# EAGLE design tarjeta-v8 (EAGLE 6.4)
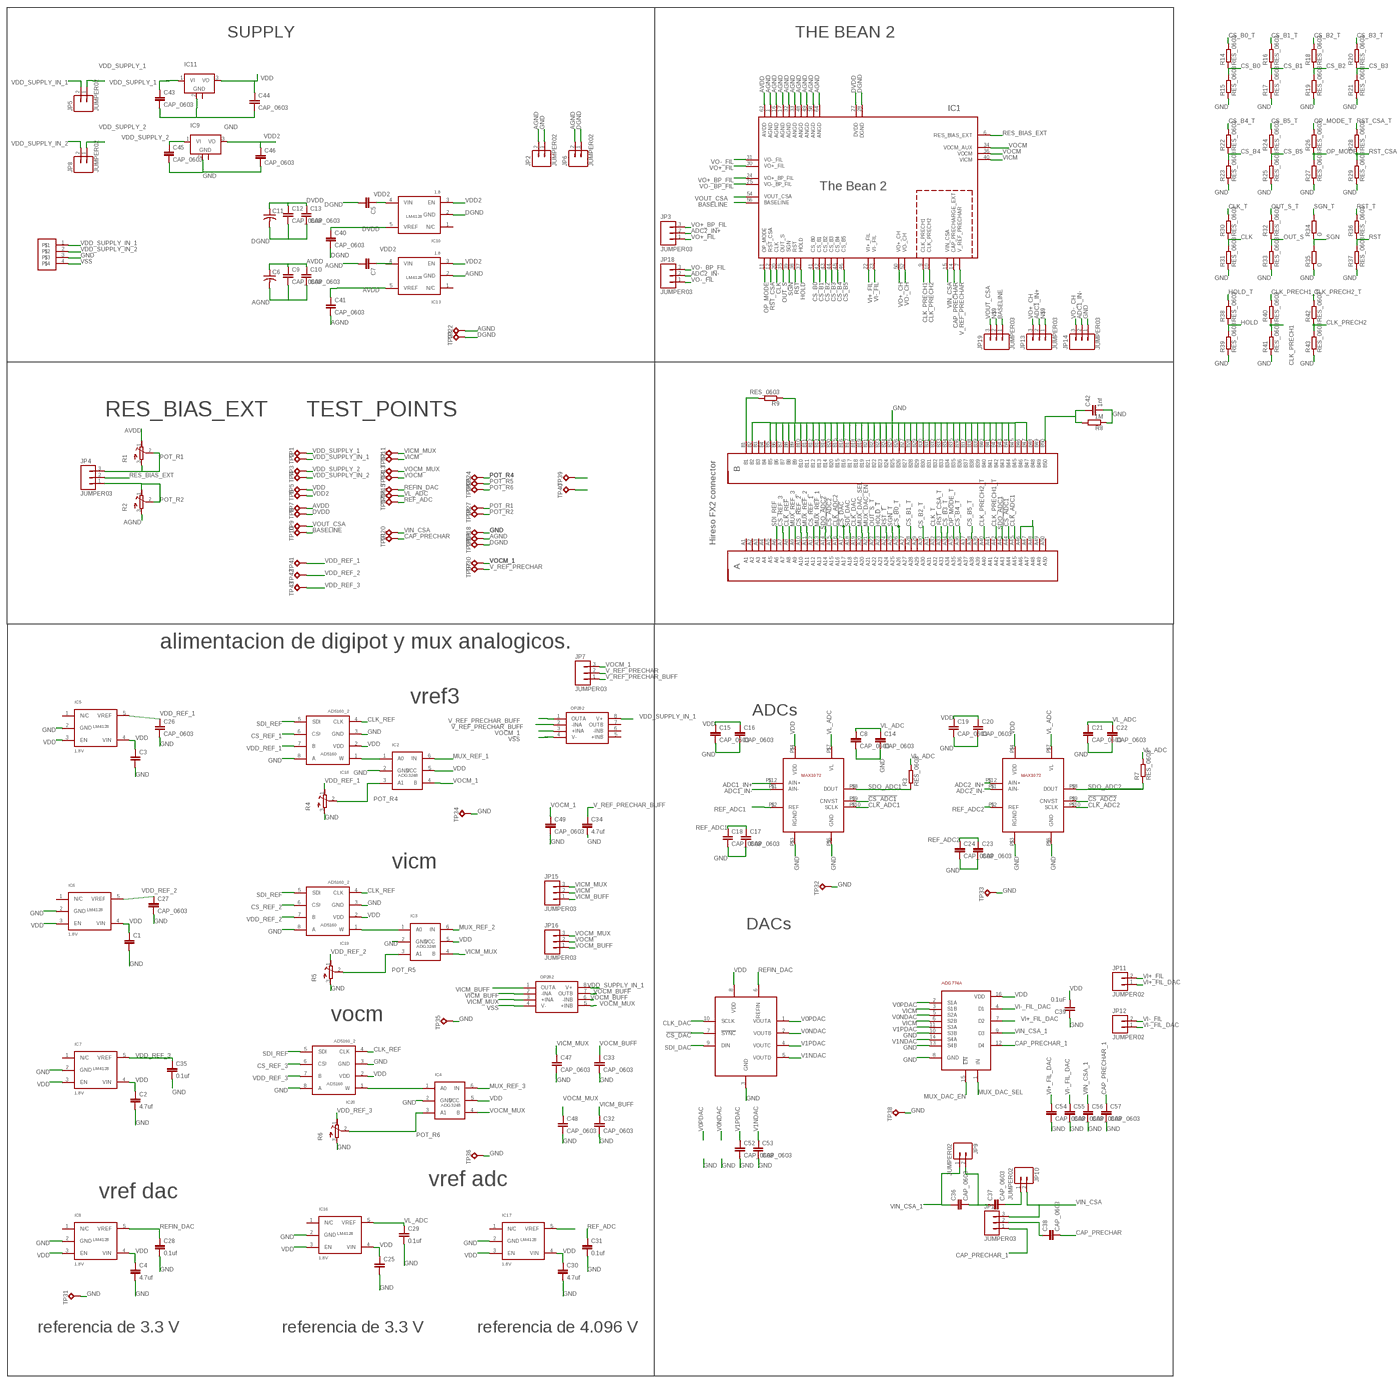
[diagram p0: schematic, sheet 1, overview]
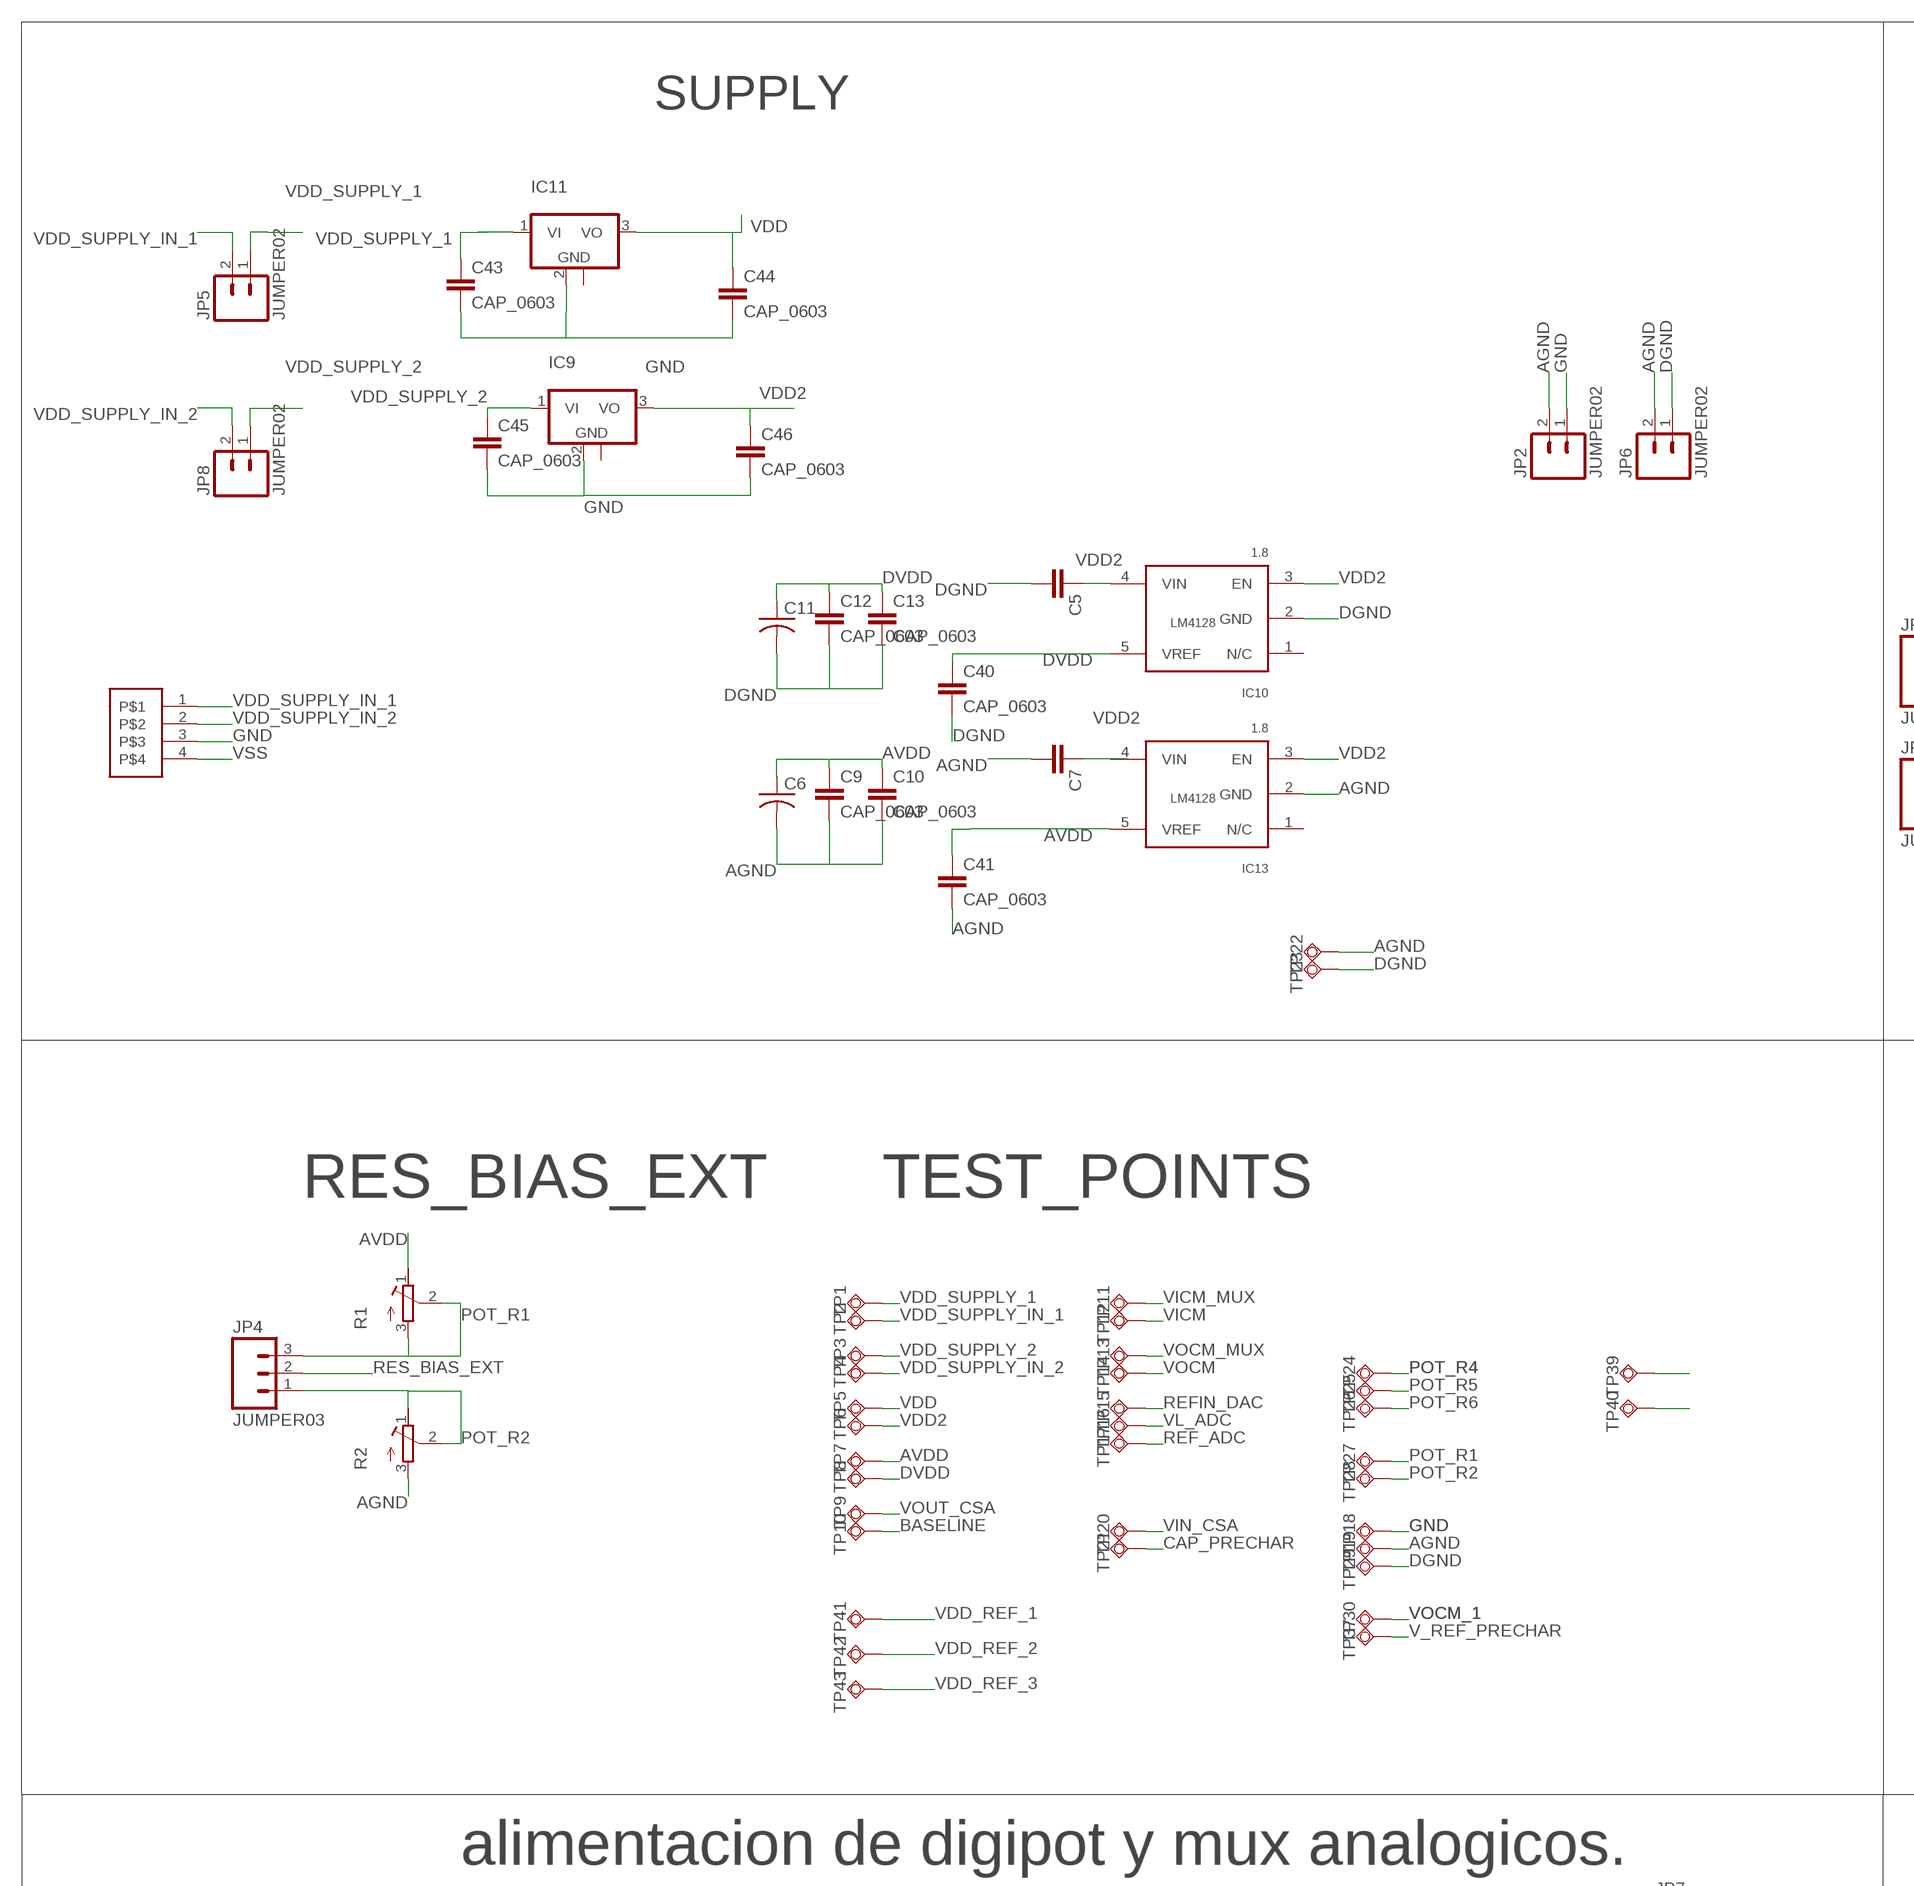
[diagram p1: schematic, sheet 1, part 1 of 4]
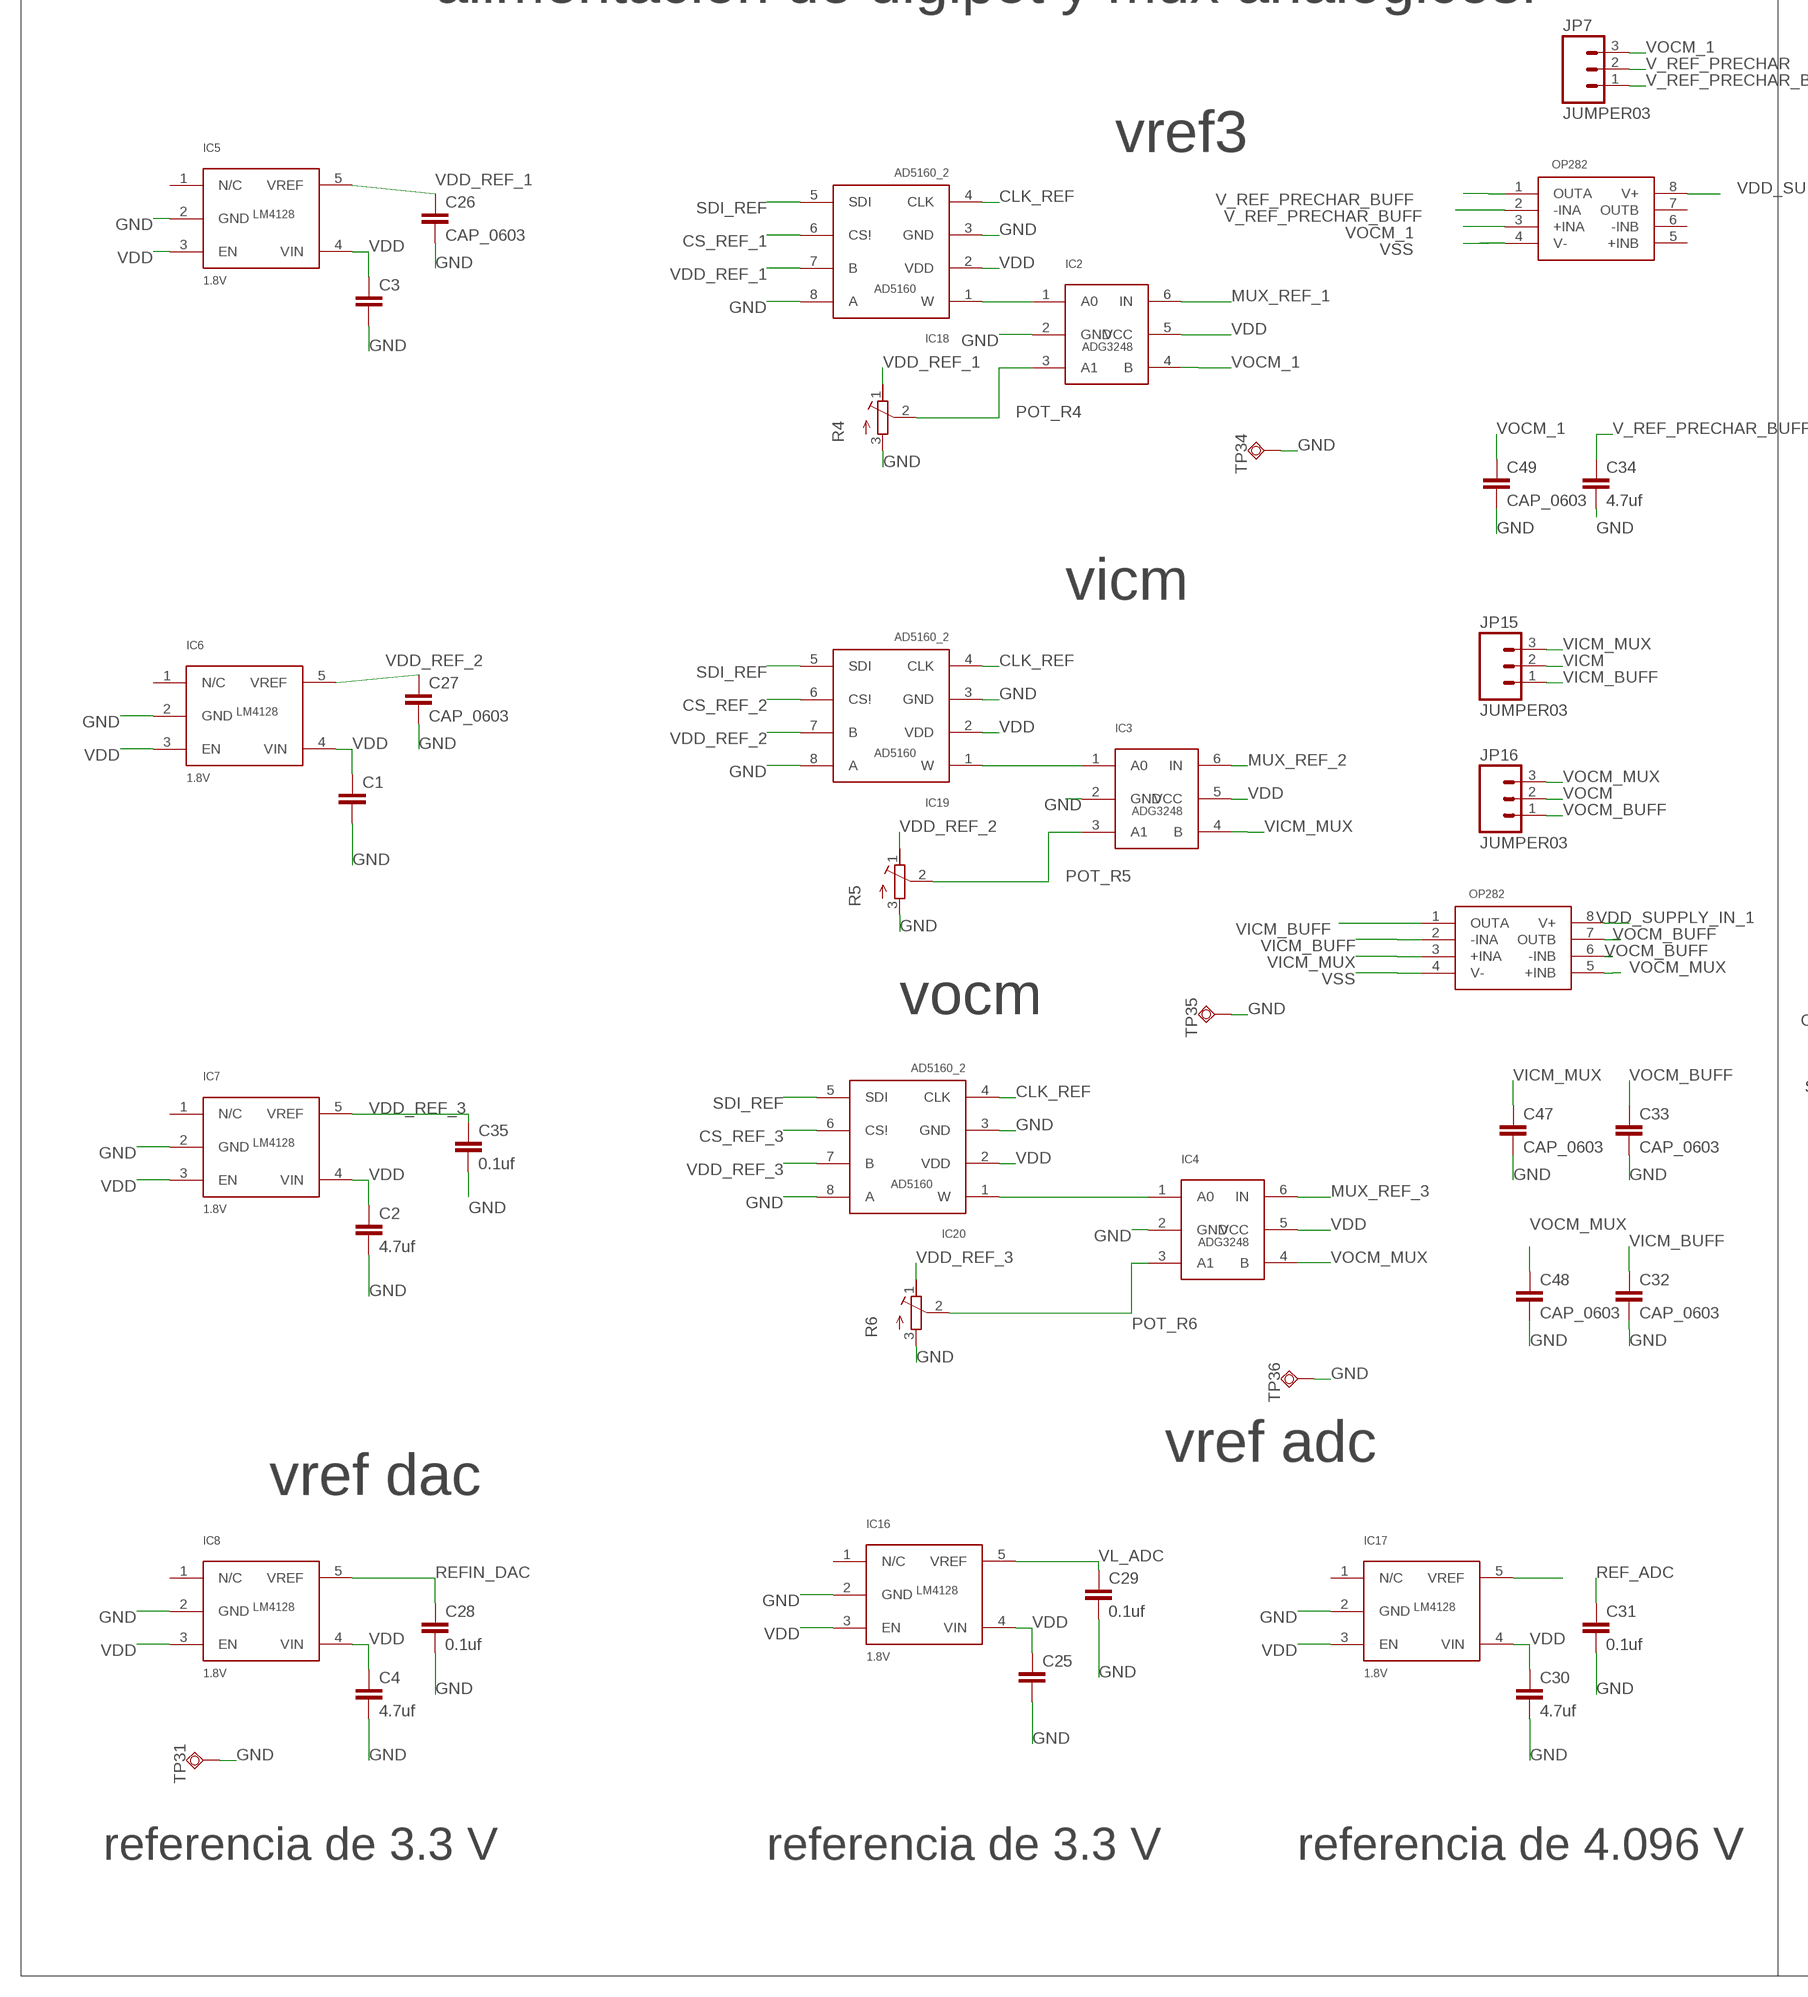
[diagram p2: schematic, sheet 1, part 2 of 4]
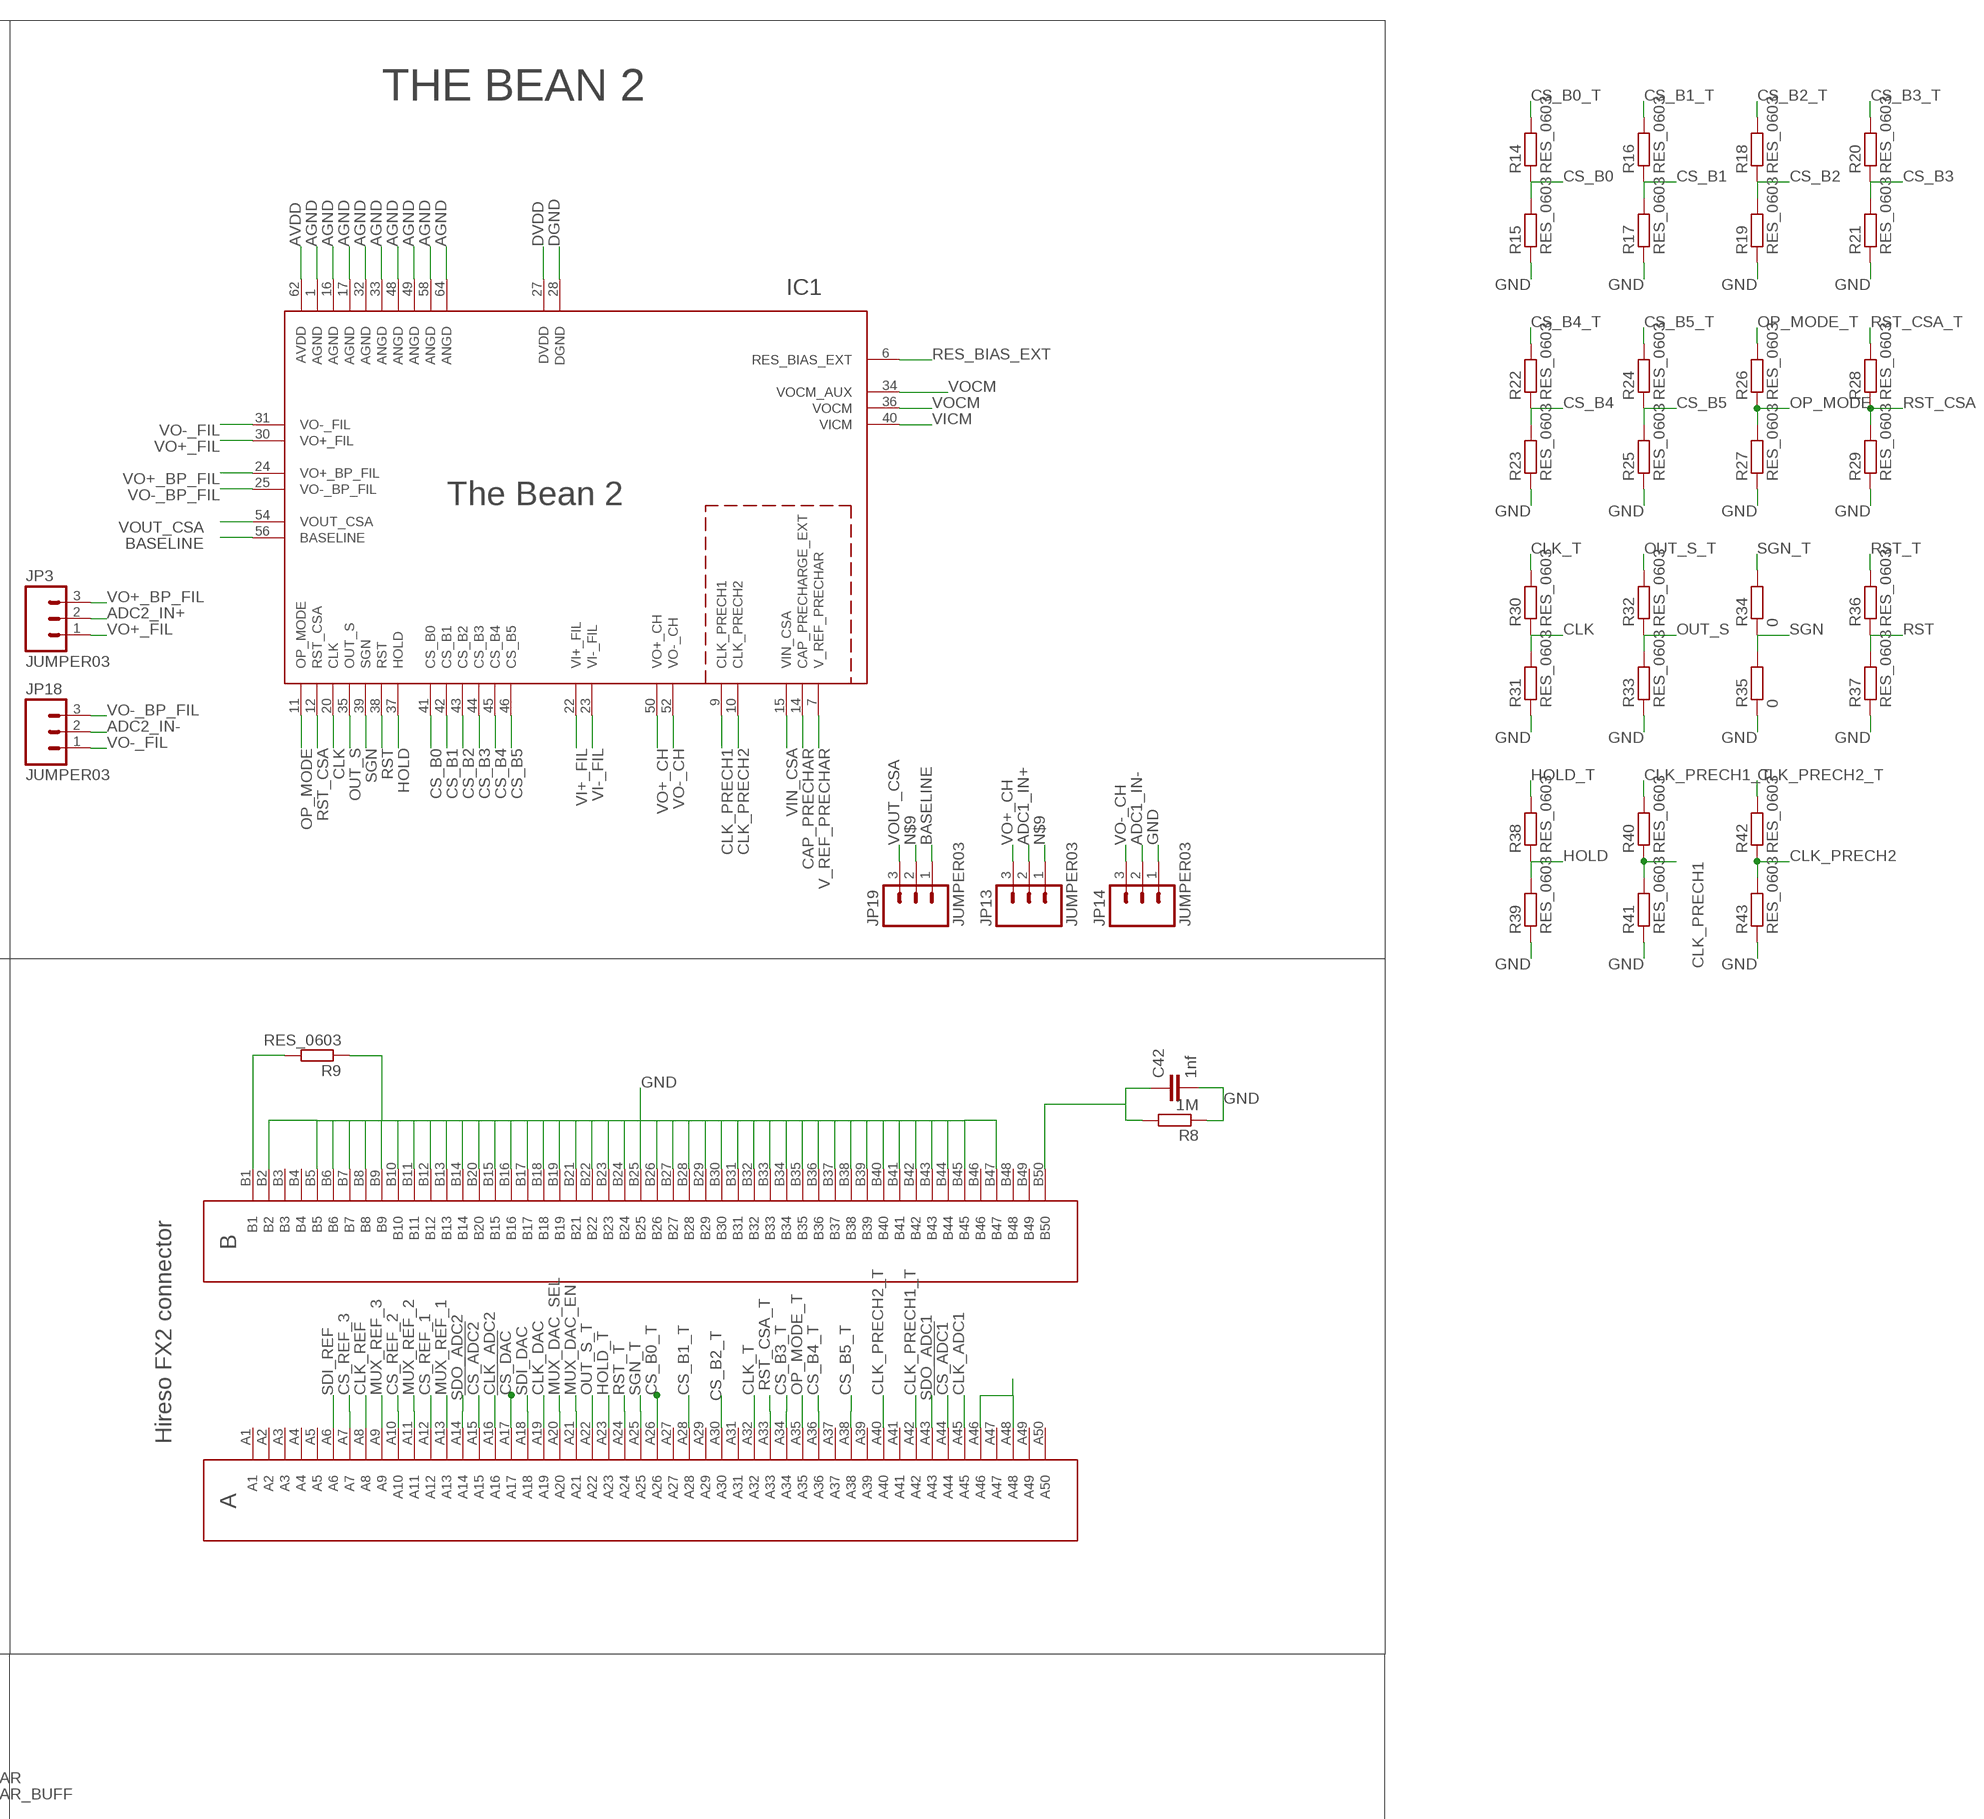
[diagram p3: schematic, sheet 1, part 3 of 4]
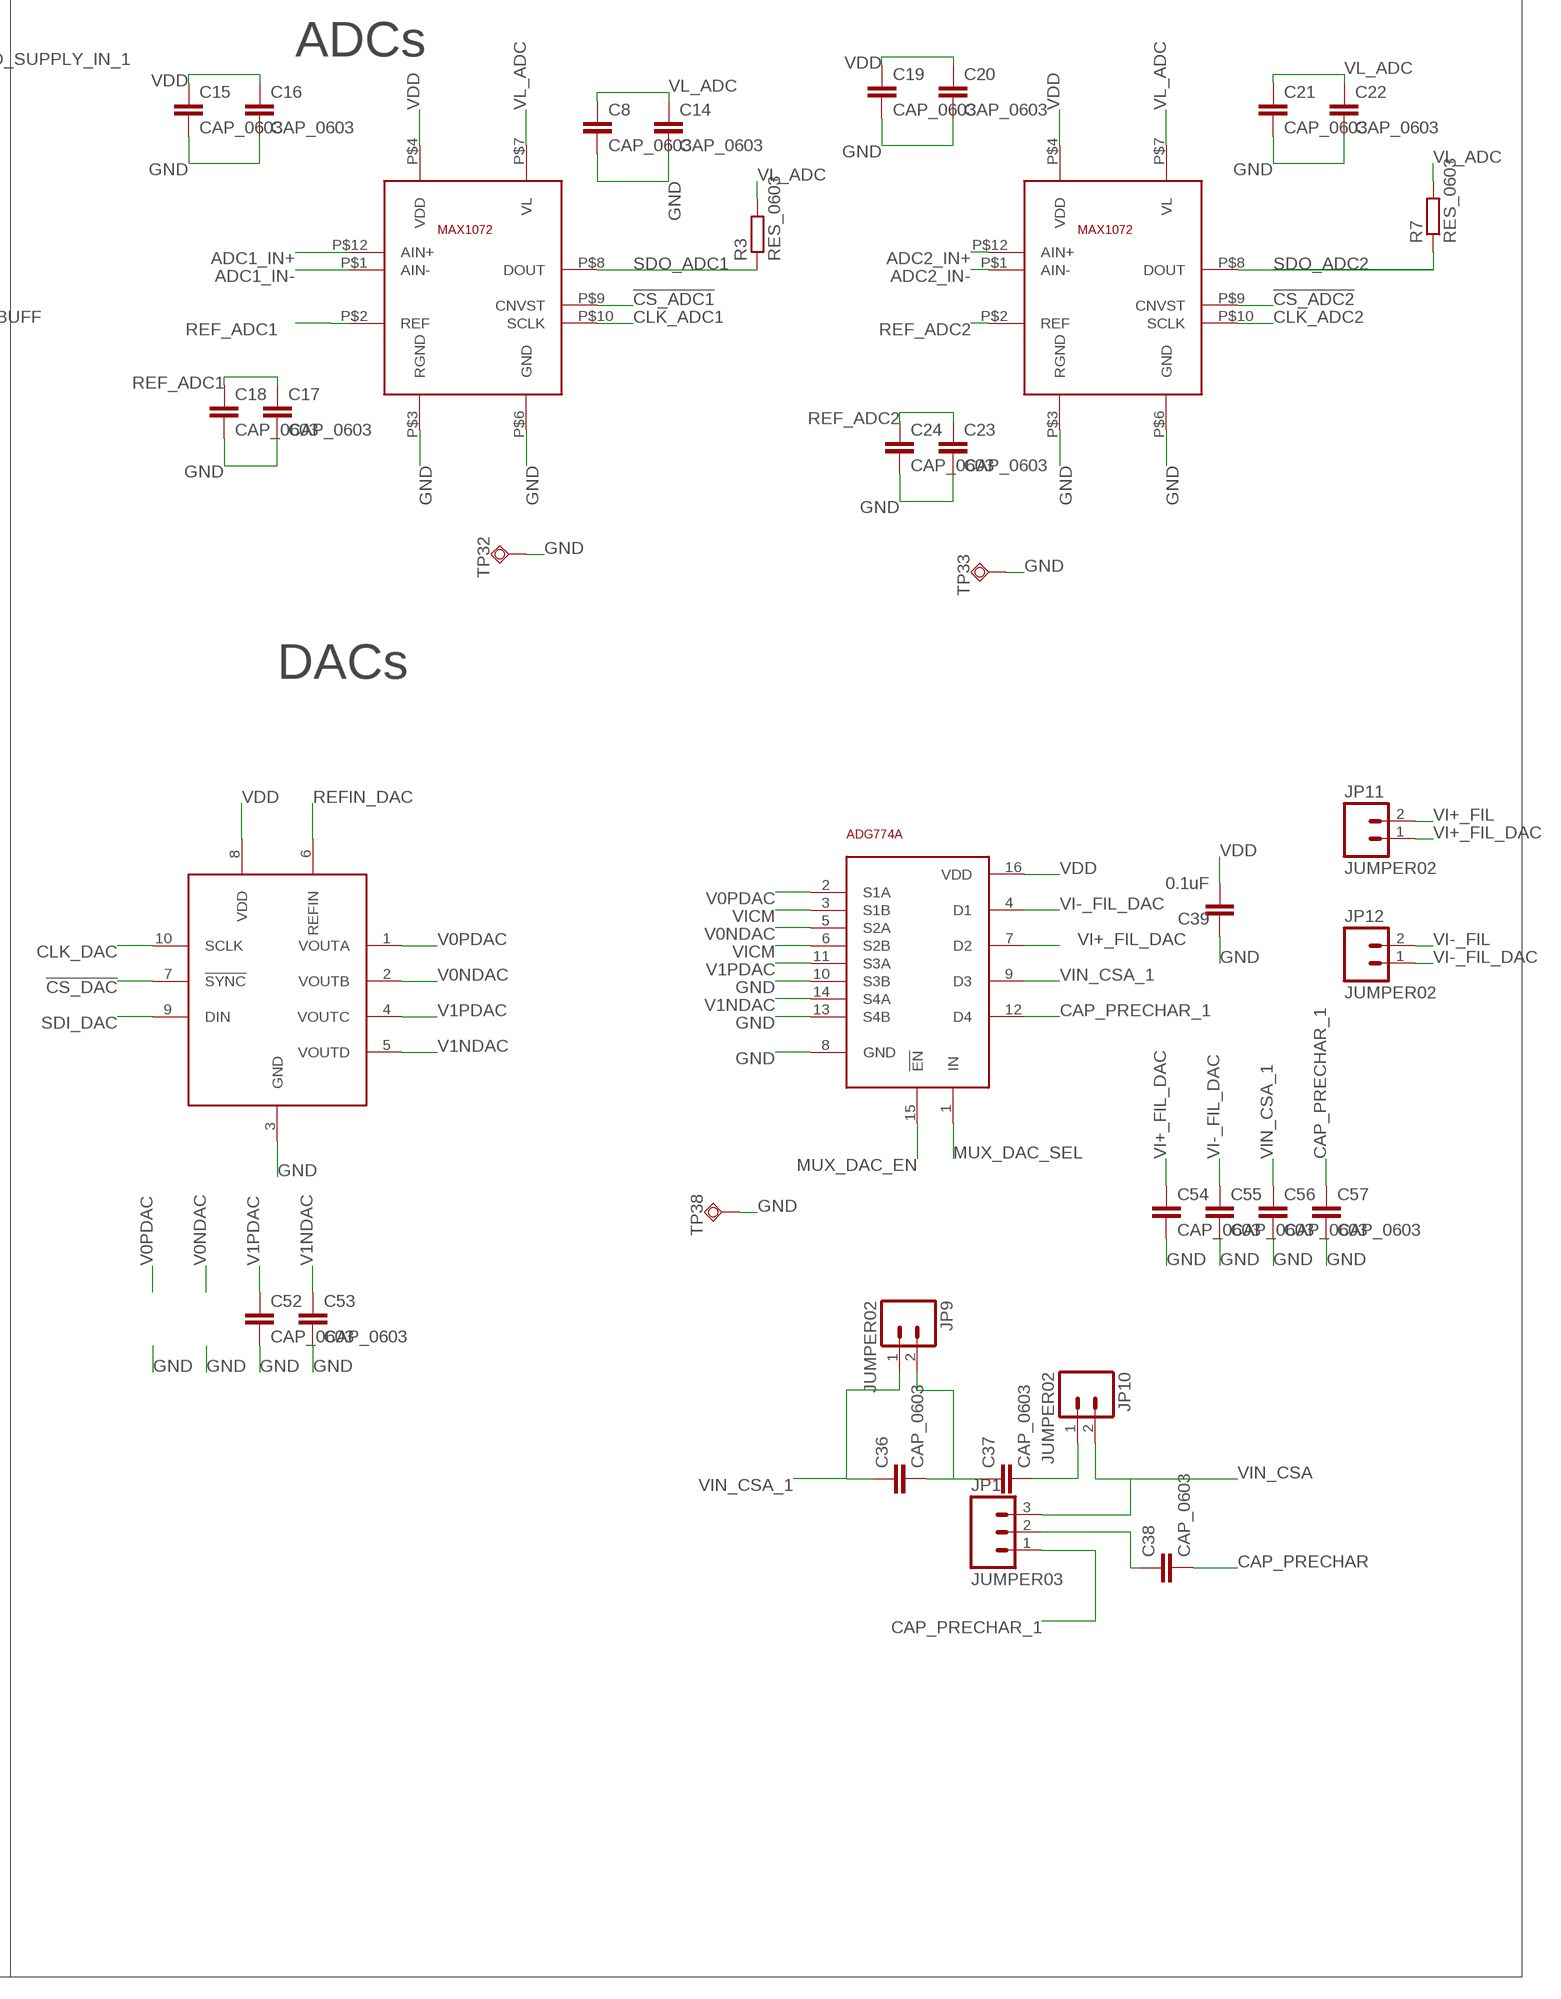
[diagram p4: schematic, sheet 1, part 4 of 4]

## Parts
C1  CAP_0402  [C0402]
C2  4.7uf  CAP_0402  [C0402]
C3  CAP_0402  [C0402]
C4  4.7uf  CAP_0402  [C0402]
C5  CAP_0402  [C0402]
C6  CAP_0805  [C0805]
C7  CAP_0402  [C0402]
C8  CAP_0603  [C0603]
C9  CAP_0603  [C0603]
C10  CAP_0603  [C0603]
C11  CAP_0805  [C0805]
C12  CAP_0603  [C0603]
C13  CAP_0603  [C0603]
C14  CAP_0603  [C0603]
C15  CAP_0603  [C0603]
C16  CAP_0603  [C0603]
C17  CAP_0603  [C0603]
C18  CAP_0603  [C0603]
C19  CAP_0603  [C0603]
C20  CAP_0603  [C0603]
C21  CAP_0603  [C0603]
C22  CAP_0603  [C0603]
C23  CAP_0603  [C0603]
C24  CAP_0603  [C0603]
C25  CAP_0402  [C0402]
C26  CAP_0603  [C0603]
C27  CAP_0603  [C0603]
C28  0.1uf  CAP_0603  [C0603]
C29  0.1uf  CAP_0603  [C0603]
C30  4.7uf  CAP_0402  [C0402]
C31  0.1uf  CAP_0603  [C0603]
C32  CAP_0603  [C0603]
C33  CAP_0603  [C0603]
C34  4.7uf  CAP_0603  [C0603]
C35  0.1uf  CAP_0603  [C0603]
C36  CAP_0603  [C0603]
C37  CAP_0603  [C0603]
C38  CAP_0603  [C0603]
C39  0.1uF  CAP_0603  [C0603]
C40  CAP_0603  [C0603]
C41  CAP_0603  [C0603]
C42  1nf  CAP_0603  [C0603]
C43  CAP_0603  [C0603]
C44  CAP_0603  [C0603]
C45  CAP_0603  [C0603]
C46  CAP_0603  [C0603]
C47  CAP_0603  [C0603]
C48  CAP_0603  [C0603]
C49  CAP_0603  [C0603]
C52  CAP_0603  [C0603]
C53  CAP_0603  [C0603]
C54  CAP_0603  [C0603]
C55  CAP_0603  [C0603]
C56  CAP_0603  [C0603]
C57  CAP_0603  [C0603]
IC1  THE_BEAN_2  [QFN64]
IC2  ADG3248  [SC70]
IC3  ADG3248  [SC70]
IC4  ADG3248  [SC70]
IC5  1.8V  LM4128_2  [SOT23-5L_2]
IC6  1.8V  LM4128_2  [SOT23-5L_2]
IC7  1.8V  LM4128_2  [SOT23-5L_2]
IC8  1.8V  LM4128_2  [SOT23-5L_2]
IC9  UA78M33DCY  [SOT223]
IC10  1.8  LM4128_2  [SOT23-5L_2]
IC11  UA78M33DCY  [SOT223]
IC12  OP282  [MSOP8]
IC13  1.8  LM4128_2  [SOT23-5L_2]
IC14  OP282  [MSOP8]
IC16  1.8V  LM4128_2  [SOT23-5L_2]
IC17  1.8V  LM4128_2  [SOT23-5L_2]
IC18  AD5160_2  [SOT23-8_2]
IC19  AD5160_2  [SOT23-8_2]
IC20  AD5160_2  [SOT23-8_2]
IC21  ADG774A  [QSOP16]
IC22  MAX1072  [TQFN12]
IC23  DAC7554  [MSOP10]
J1  HIRESO_FX_CONNECTOR  [FX2-100S-1.27]
JP1  JUMPER03  [1X03]
JP2  JUMPER02  [1X02]
JP3  JUMPER03  [1X03]
JP4  JUMPER03  [1X03]
JP5  JUMPER02  [1X02]
JP6  JUMPER02  [1X02]
JP7  JUMPER03  [1X03]
JP8  JUMPER02  [1X02]
JP9  JUMPER02  [1X02]
JP10  JUMPER02  [1X02]
JP11  JUMPER02  [1X02]
JP12  JUMPER02  [1X02]
JP13  JUMPER03  [1X03]
JP14  JUMPER03  [1X03]
JP15  JUMPER03  [1X03]
JP16  JUMPER03  [1X03]
JP17  JUMPER04  [1X04]
JP18  JUMPER03  [1X03]
JP19  JUMPER03  [1X03]
R1  TRIMMER_ST5  [ST-5EW]
R2  TRIMMER_ST5  [ST-5EW]
R3  RES_0603  [R0603]
R4  TRIMMER_ST5  [ST-5EW]
R5  TRIMMER_ST5  [ST-5EW]
R6  TRIMMER_ST5  [ST-5EW]
R7  RES_0603  [R0603]
R8  1M  RES_0603  [R0603]
R9  RES_0603  [R0603]
R14  RES_0603  [R0603]
R15  RES_0603  [R0603]
R16  RES_0603  [R0603]
R17  RES_0603  [R0603]
R18  RES_0603  [R0603]
R19  RES_0603  [R0603]
R20  RES_0603  [R0603]
R21  RES_0603  [R0603]
R22  RES_0603  [R0603]
R23  RES_0603  [R0603]
R24  RES_0603  [R0603]
R25  RES_0603  [R0603]
R26  RES_0603  [R0603]
R27  RES_0603  [R0603]
R28  RES_0603  [R0603]
R29  RES_0603  [R0603]
R30  RES_0603  [R0603]
R31  RES_0603  [R0603]
R32  RES_0603  [R0603]
R33  RES_0603  [R0603]
R34  0  RES_0603  [R0603]
R35  0  RES_0603  [R0603]
R36  RES_0603  [R0603]
R37  RES_0603  [R0603]
R38  RES_0603  [R0603]
R39  RES_0603  [R0603]
R40  RES_0603  [R0603]
R41  RES_0603  [R0603]
R42  RES_0603  [R0603]
R43  RES_0603  [R0603]
TP1  TEST_POINT  [TP]
TP2  TEST_POINT  [TP]
TP3  TEST_POINT  [TP]
TP4  TEST_POINT  [TP]
TP5  TEST_POINT  [TP]
TP6  TEST_POINT  [TP]
TP7  TEST_POINT  [TP]
TP8  TEST_POINT  [TP]
TP9  TEST_POINT  [TP]
TP10  TEST_POINT  [TP]
TP11  TEST_POINT  [TP]
TP12  TEST_POINT  [TP]
TP13  TEST_POINT  [TP]
TP14  TEST_POINT  [TP]
TP15  TEST_POINT  [TP]
TP16  TEST_POINT  [TP]
TP17  TEST_POINT  [TP]
TP18  TEST_POINT  [TP]
TP19  TEST_POINT  [TP]
TP20  TEST_POINT  [TP]
TP21  TEST_POINT  [TP]
TP22  TEST_POINT  [TP]
TP23  TEST_POINT  [TP]
TP24  TEST_POINT  [TP]
TP25  TEST_POINT  [TP]
TP26  TEST_POINT  [TP]
TP27  TEST_POINT  [TP]
TP28  TEST_POINT  [TP]
TP29  TEST_POINT  [TP]
TP30  TEST_POINT  [TP]
TP31  TEST_POINT  [TP]
TP32  TEST_POINT  [TP]
TP33  TEST_POINT  [TP]
TP34  TEST_POINT  [TP]
TP35  TEST_POINT  [TP]
TP36  TEST_POINT  [TP]
TP37  TEST_POINT  [TP]
TP38  TEST_POINT  [TP]
TP39  TEST_POINT  [TP]
TP40  TEST_POINT  [TP]
TP41  TEST_POINT  [TP]
TP42  TEST_POINT  [TP]
TP43  TEST_POINT  [TP]
U$5  MAX1072  [TQFN12]

## Nets
!CS_ADC1: IC22.P$9(CNVST) J1.A44
!CS_ADC2: J1.A15 U$5.P$9(CNVST)
!CS_DAC: IC23.7(!SYNC) J1.A17
ADC1_IN+: IC22.P$12(AIN+) JP13.2
ADC1_IN-: IC22.P$1(AIN-) JP14.2
ADC2_IN+: JP3.2 U$5.P$12(AIN+)
ADC2_IN-: JP18.2 U$5.P$1(AIN-)
AGND: C6.2 C7.2 C9.2 C10.2 C41.2 IC1.1(AGND) IC1.16(AGND) IC1.17(AGND) IC1.32(AGND) IC1.33(ANGD) IC1.48(ANGD) IC1.49(ANGD) IC1.58(ANGD) IC1.64(ANGD) IC13.2(GND) JP2.2 JP6.2 R2.3 TP19.TP TP22.TP
AVDD: C6.1 C9.1 C10.1 C41.1 IC1.62(AVDD) IC13.5(VREF) R1.1 TP7.TP
BASELINE: IC1.56(BASELINE) JP19.1 TP10.TP
CAP_PRECHAR: C38.2 IC1.14(CAP_PRECHARGE_EXT) TP21.TP
CAP_PRECHAR_1: C57.1 IC21.12(D4) JP1.1
CLK: IC1.20(CLK) R30.1 R31.2
CLK_ADC1: IC22.P$10(SCLK) J1.A45
CLK_ADC2: J1.A16 U$5.P$10(SCLK)
CLK_DAC: IC23.10(SCLK) J1.A19
CLK_PRECH1: IC1.9(CLK_PRECH1) R40.1 R41.2
CLK_PRECH1_T: J1.A42 R40.2
CLK_PRECH2: IC1.10(CLK_PRECH2) R42.1 R43.2
CLK_PRECH2_T: J1.A40 R42.2
CLK_REF: IC18.4(CLK) IC19.4(CLK) IC20.4(CLK) J1.A8
CLK_T: J1.A32 R30.2
CS_B0: IC1.41(CS_B0) R14.1 R15.2
CS_B0_T: J1.A26 R14.2
CS_B1: IC1.42(CS_B1) R16.1 R17.2
CS_B1_T: J1.A28 R16.2
CS_B2: IC1.43(CS_B2) R18.1 R19.2
CS_B2_T: J1.A30 R18.2
CS_B3: IC1.44(CS_B3) R20.1 R21.2
CS_B3_T: J1.A34 R20.2
CS_B4: IC1.45(CS_B4) R22.1 R23.2
CS_B4_T: J1.A36 R22.2
CS_B5: IC1.46(CS_B5) R24.1 R25.2
CS_B5_T: J1.A38 R24.2
CS_REF_1: IC18.6(CS!) J1.A12
CS_REF_2: IC19.6(CS!) J1.A10
CS_REF_3: IC20.6(CS!) J1.A7
DGND: C5.2 C11.2 C12.2 C13.2 C40.2 IC1.28(DGND) IC10.2(GND) JP6.1 TP23.TP TP29.TP
DVDD: C11.1 C12.1 C13.1 C40.1 IC1.27(DVDD) IC10.5(VREF) TP8.TP
GND: C1.2 C2.2 C3.2 C4.2 C8.2 C14.2 C15.2 C16.2 C17.2 C18.2 C19.2 C20.2 C21.2 C22.2 C23.2 C24.2 C25.2 C26.2 C27.2 C28.2 C29.2 C30.2 C31.2 C32.2 C33.2 C34.2 C35.2 C39.1 C42.2 C43.2 C44.2 C45.2 C46.2 C47.2 C48.2 C49.2 C52.2 C53.2 C54.2 C55.2 C56.2 C57.2 IC2.2(GND) IC3.2(GND) IC4.2(GND) IC5.2(GND) IC6.2(GND) IC7.2(GND) IC8.2(GND) IC9.2(GND) IC11.2(GND) IC16.2(GND) IC17.2(GND) IC18.3(GND) IC18.8(A) IC19.3(GND) IC19.8(A) IC20.3(GND) IC20.8(A) IC21.8(GND) IC21.10(S3B) IC21.13(S4B) IC22.P$3(RGND) IC22.P$6(GND) IC23.3(GND) J1.B2 J1.B5 J1.B6 J1.B7 J1.B8 J1.B9 J1.B10 J1.B11 J1.B12 J1.B13 J1.B14 J1.B15 J1.B16 J1.B17 J1.B18 J1.B19 J1.B20 J1.B21 J1.B22 J1.B23 J1.B24 J1.B25 J1.B26 J1.B27 J1.B28 J1.B29 J1.B30 J1.B31 J1.B32 J1.B33 J1.B34 J1.B35 J1.B36 J1.B37 J1.B38 J1.B39 J1.B40 J1.B41 J1.B42 J1.B43 J1.B44 J1.B45 J1.B47 JP2.1 JP14.1 JP17.3 R4.3 R5.3 R6.3 R8.1 R9.1 R15.1 R17.1 R19.1 R21.1 R23.1 R25.1 R27.1 R29.1 R31.1 R33.1 R35.1 R37.1 R39.1 R41.1 R43.1 TP18.TP TP31.TP TP32.TP TP33.TP TP34.TP TP35.TP TP36.TP TP38.TP U$5.P$3(RGND) U$5.P$6(GND)
HOLD: IC1.37(HOLD) R38.1 R39.2
HOLD_T: J1.A23 R38.2
MUX_DAC_EN: IC21.15(!EN) J1.A21
MUX_DAC_SEL: IC21.1(IN) J1.A20
MUX_REF_1: IC2.6(IN) J1.A13
MUX_REF_2: IC3.6(IN) J1.A11
MUX_REF_3: IC4.6(IN) J1.A9
N$1: C36.2 C37.1 JP9.2
N$2: J1.B1 R9.2
N$3: C37.2 JP10.1
N$4: J1.A46 J1.A48
N$5: IC4.1(A0) IC20.1(W)
N$6: C38.1 JP1.2
N$7: IC17.5(VREF)
N$9: JP13.1 JP19.2
N$10: C42.1 J1.B50 R8.2
N$17: IC2.1(A0) IC18.1(W)
N$19: IC3.1(A0) IC19.1(W)
OP_MODE: IC1.11(OP_MODE) R26.1 R27.2
OP_MODE_T: J1.A35 R26.2
OUT_S: IC1.35(OUT_S) R32.1 R33.2
OUT_S_T: J1.A22 R32.2
POT_R1: JP4.3 R1.2 R1.3 TP27.TP
POT_R2: JP4.1 R2.1 R2.2 TP28.TP
POT_R4: IC2.3(A1) R4.2 TP24.TP
POT_R5: IC3.3(A1) R5.2 TP25.TP
POT_R6: IC4.3(A1) R6.2 TP26.TP
REF_ADC: C31.1 TP17.TP
REF_ADC1: C17.1 C18.1 IC22.P$2(REF) TP39.TP
REF_ADC2: C23.1 C24.1 TP40.TP U$5.P$2(REF)
REFIN_DAC: C28.1 IC8.5(VREF) IC23.6(REFIN) TP15.TP
RES_BIAS_EXT: IC1.6(RES_BIAS_EXT) JP4.2
RST: IC1.38(RST) R36.1 R37.2
RST_CSA: IC1.12(RST_CSA) R28.1 R29.2
RST_CSA_T: J1.A33 R28.2
RST_T: J1.A24 R36.2
SDI_DAC: IC23.9(DIN) J1.A18
SDI_REF: IC18.5(SDI) IC19.5(SDI) IC20.5(SDI) J1.A6
SDO_ADC1: IC22.P$8(DOUT) J1.A43 R3.1
SDO_ADC2: J1.A14 R7.1 U$5.P$8(DOUT)
SGN: IC1.39(SGN) R34.1 R35.2
SGN_T: J1.A25 R34.2
V0NDAC: IC21.5(S2A) IC23.2(VOUTB)
V0PDAC: IC21.2(S1A) IC23.1(VOUTA)
V1NDAC: C53.1 IC21.14(S4A) IC23.5(VOUTD)
V1PDAC: C52.1 IC21.11(S3A) IC23.4(VOUTC)
V_REF_PRECHAR: IC1.7(V_REF_PRECHAR) JP7.2 TP37.TP
V_REF_PRECHAR_BUFF: C34.1 IC14.1(OUTA) IC14.2(-INA) JP7.1
VDD: C1.1 C2.1 C3.1 C4.1 C15.1 C16.1 C19.1 C20.1 C25.1 C30.1 C39.2 C44.1 IC2.5(VCC) IC3.5(VCC) IC4.5(VCC) IC5.3(EN) IC5.4(VIN) IC6.3(EN) IC6.4(VIN) IC7.3(EN) IC7.4(VIN) IC8.3(EN) IC8.4(VIN) IC11.3(VO) IC16.3(EN) IC16.4(VIN) IC17.3(EN) IC17.4(VIN) IC18.2(VDD) IC19.2(VDD) IC20.2(VDD) IC21.16(VDD) IC22.P$4(VDD) IC23.8(VDD) TP5.TP U$5.P$4(VDD)
VDD2: C5.1 C7.1 C46.1 IC9.3(VO) IC10.3(EN) IC10.4(VIN) IC13.3(EN) IC13.4(VIN) TP6.TP
VDD_REF_1: C26.1 IC5.5(VREF) IC18.7(B) R4.1 TP41.TP
VDD_REF_2: C27.1 IC6.5(VREF) IC19.7(B) R5.1 TP42.TP
VDD_REF_3: C35.1 IC7.5(VREF) IC20.7(B) R6.1 TP43.TP
VDD_SUPPLY_1: C43.1 IC11.1(VI) JP5.1 TP1.TP
VDD_SUPPLY_2: C45.1 IC9.1(VI) JP8.1 TP3.TP
VDD_SUPPLY_IN_1: IC12.8(V+) IC14.8(V+) JP5.2 JP17.1 TP2.TP
VDD_SUPPLY_IN_2: JP8.2 JP17.2 TP4.TP
VI+_FIL: IC1.22(VI+_FIL) JP11.2
VI+_FIL_DAC: C54.1 IC21.4(D1) JP11.1
VI-_FIL: IC1.23(VI-_FIL) JP12.2
VI-_FIL_DAC: C55.1 IC21.7(D2) JP12.1
VICM: IC1.40(VICM) IC21.3(S1B) IC21.6(S2B) JP15.2 TP12.TP
VICM_BUFF: C32.1 IC12.1(OUTA) IC12.2(-INA) JP15.1
VICM_MUX: C47.1 IC3.4(B) IC12.3(+INA) JP15.3 TP11.TP
VIN_CSA: IC1.15(VIN_CSA) JP1.3 JP10.2 TP20.TP
VIN_CSA_1: C36.1 C56.1 IC21.9(D3) JP9.1
VL_ADC: C8.1 C14.1 C21.1 C22.1 C29.1 IC16.5(VREF) IC22.P$7(VL) R3.2 R7.2 TP16.TP U$5.P$7(VL)
VO+_BP_FIL: IC1.24(VO+_BP_FIL) JP3.3
VO+_CH: IC1.50(VO+_CH) JP13.3
VO+_FIL: IC1.30(VO+_FIL) JP3.1
VO-_BP_FIL: IC1.25(VO-_BP_FIL) JP18.3
VO-_CH: IC1.52(VO-_CH) JP14.3
VO-_FIL: IC1.31(VO-_FIL) JP18.1
VOCM: IC1.34(VOCM_AUX) IC1.36(VOCM) JP16.2 TP14.TP
VOCM_1: C49.1 IC2.4(B) IC14.3(+INA) JP7.3 TP30.TP
VOCM_BUFF: C33.1 IC12.6(-INB) IC12.7(OUTB) JP16.1
VOCM_MUX: C48.1 IC4.4(B) IC12.5(+INB) JP16.3 TP13.TP
VOUT_CSA: IC1.54(VOUT_CSA) JP19.3 TP9.TP
VSS: IC12.4(V-) IC14.4(V-) JP17.4
Unconnected: IC5.1(N/C) IC6.1(N/C) IC7.1(N/C) IC8.1(N/C) IC9.4(GND) IC10.1(N/C) IC11.4(GND) IC13.1(N/C) IC14.5(+INB) IC14.6(-INB) IC14.7(OUTB) IC16.1(N/C) IC17.1(N/C) J1.A1 J1.A2 J1.A3 J1.A4 J1.A5 J1.A27 J1.A29 J1.A31 J1.A37 J1.A39 J1.A41 J1.A47 J1.A49 J1.A50 J1.B3 J1.B4 J1.B46 J1.B48 J1.B49

## Notes on the sheet
- SUPPLY | THE BEAN 2
- RES_BIAS_EXT | TEST_POINTS
- alimentacion de digipot y mux analogicos.
- vref3
- ADCs
- vicm
- DACs
- vocm
- vref adc
- vref dac
- referencia de 3.3 V | referencia de 3.3 V | referencia de 4.096 V

## Library data of the parts
C1-C5 C7 C25 C30 = wac:CAP_0402
C6 C11 = wac:CAP_0805
C8-C10 C12-C24 C26-C29 C31-C49 C52-C57 = wac:CAP_0603
IC1 = wac:THE_BEAN_2
IC2-IC4 = wac:ADG3248
IC5-IC8 IC10 IC13 IC16 IC17 = wac:LM4128_2
IC9 IC11 = linear:UA78M*: POSITIVE-VOLTAGE REGULATORS Source: http://focus.ti.com/lit/ds/symlink/ua78m33.pdf
IC12 IC14 = wac:OP282: OP282. Package:8-lead MSOP. Obtenido desde http://www.analog.com/media/en/technical-documentation/data-sheets/OP282_482.pdf
IC18-IC20 = wac:AD5160_2
IC21 = wac:ADG774A: Low voltage,400MHz, Quad 2:1 MUX with 3ns Switching Time http://www.analog.com/static/imported-files/data_sheets/ADG774A.pdf
IC22 U$5 = wac:MAX1072
IC23 = wac:DAC7554: 12-BIT, QUAD, ULTRALOW GLITCH, VOLTAGE OUTPUT DIGITAL-TO-ANALOG CONVERTER http://www.ti.com/lit/ds/symlink/dac7554.pdf
J1 = wac:HIRESO_FX_CONNECTOR: Conector Hireso de la serie FX2. Part Number: FX2-100S-1.27DS(L)
JP1 JP3 JP4 JP7 JP13-JP16 JP18 JP19 = wac:JUMPER03
JP2 JP5 JP6 JP8-JP12 = wac:JUMPER02
JP17 = wac:JUMPER04
R1 R2 R4-R6 = wac:TRIMMER_ST5
R3 R7-R9 R14-R43 = wac:RES_0603
TP1-TP43 = wac:TEST_POINT

## Board
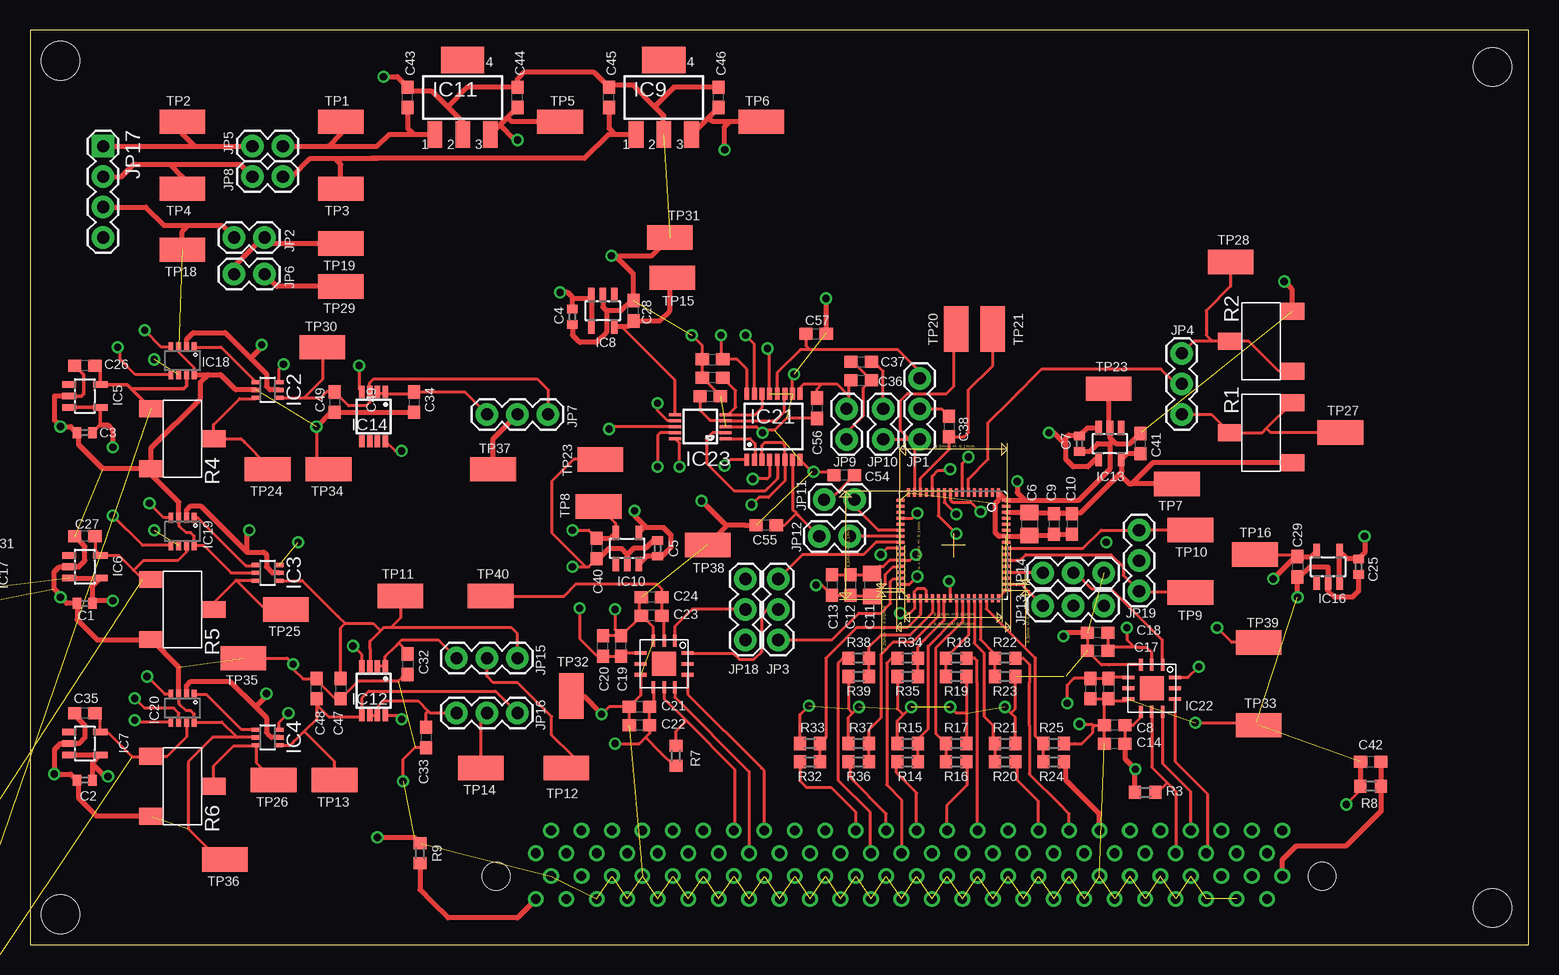
[diagram p5: board, top side]
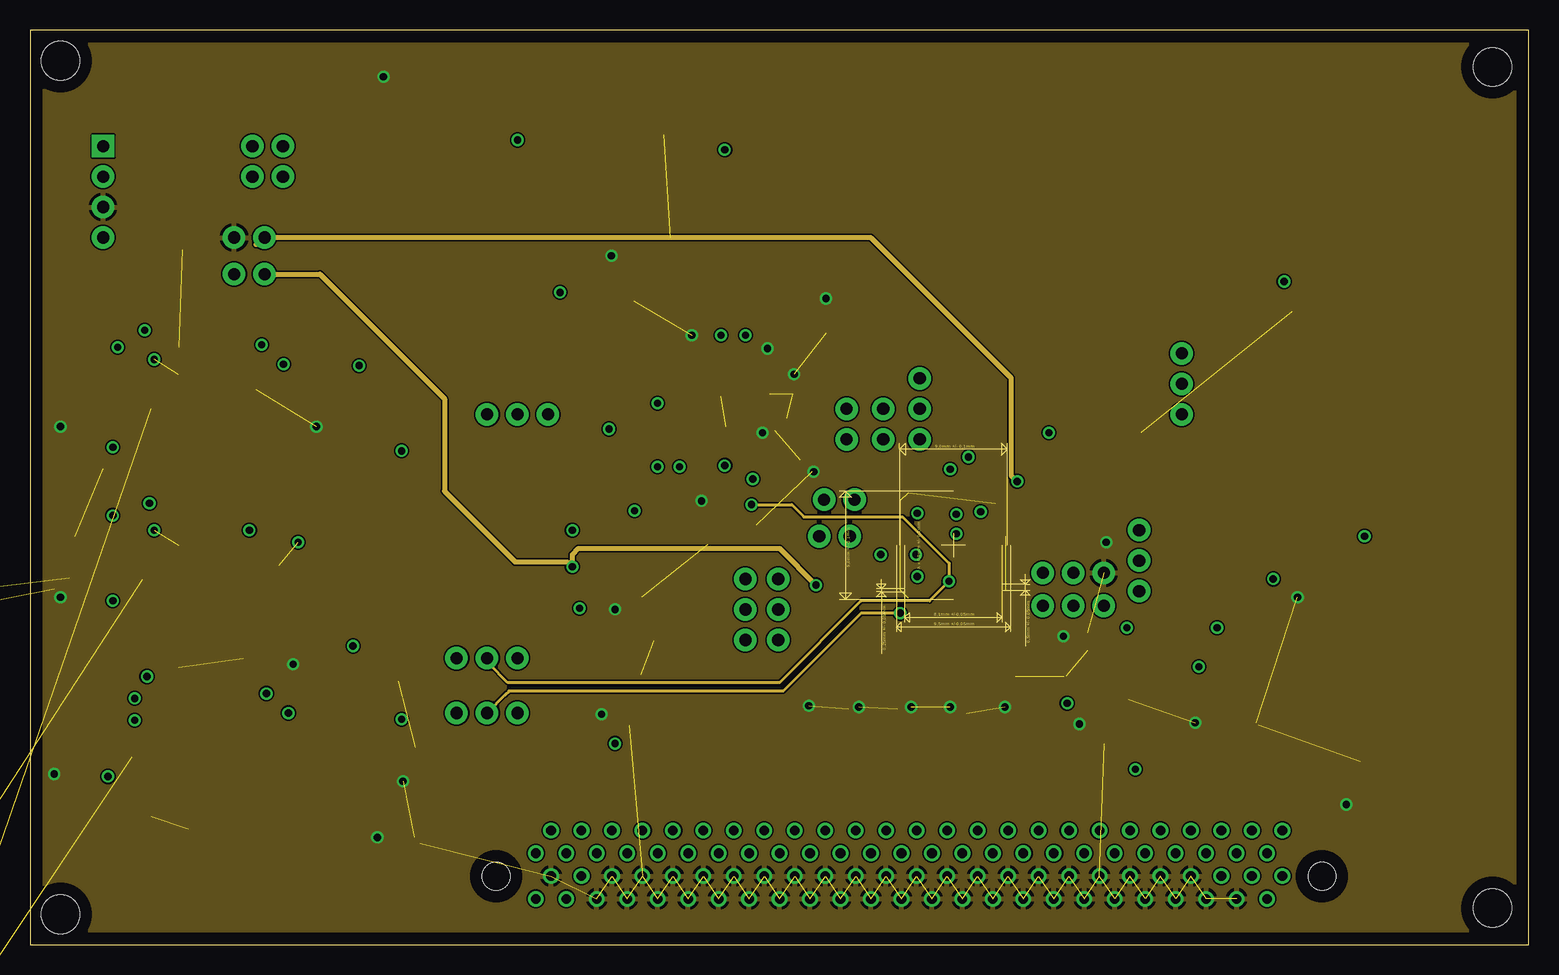
[diagram p6: board, inner layer Route2]
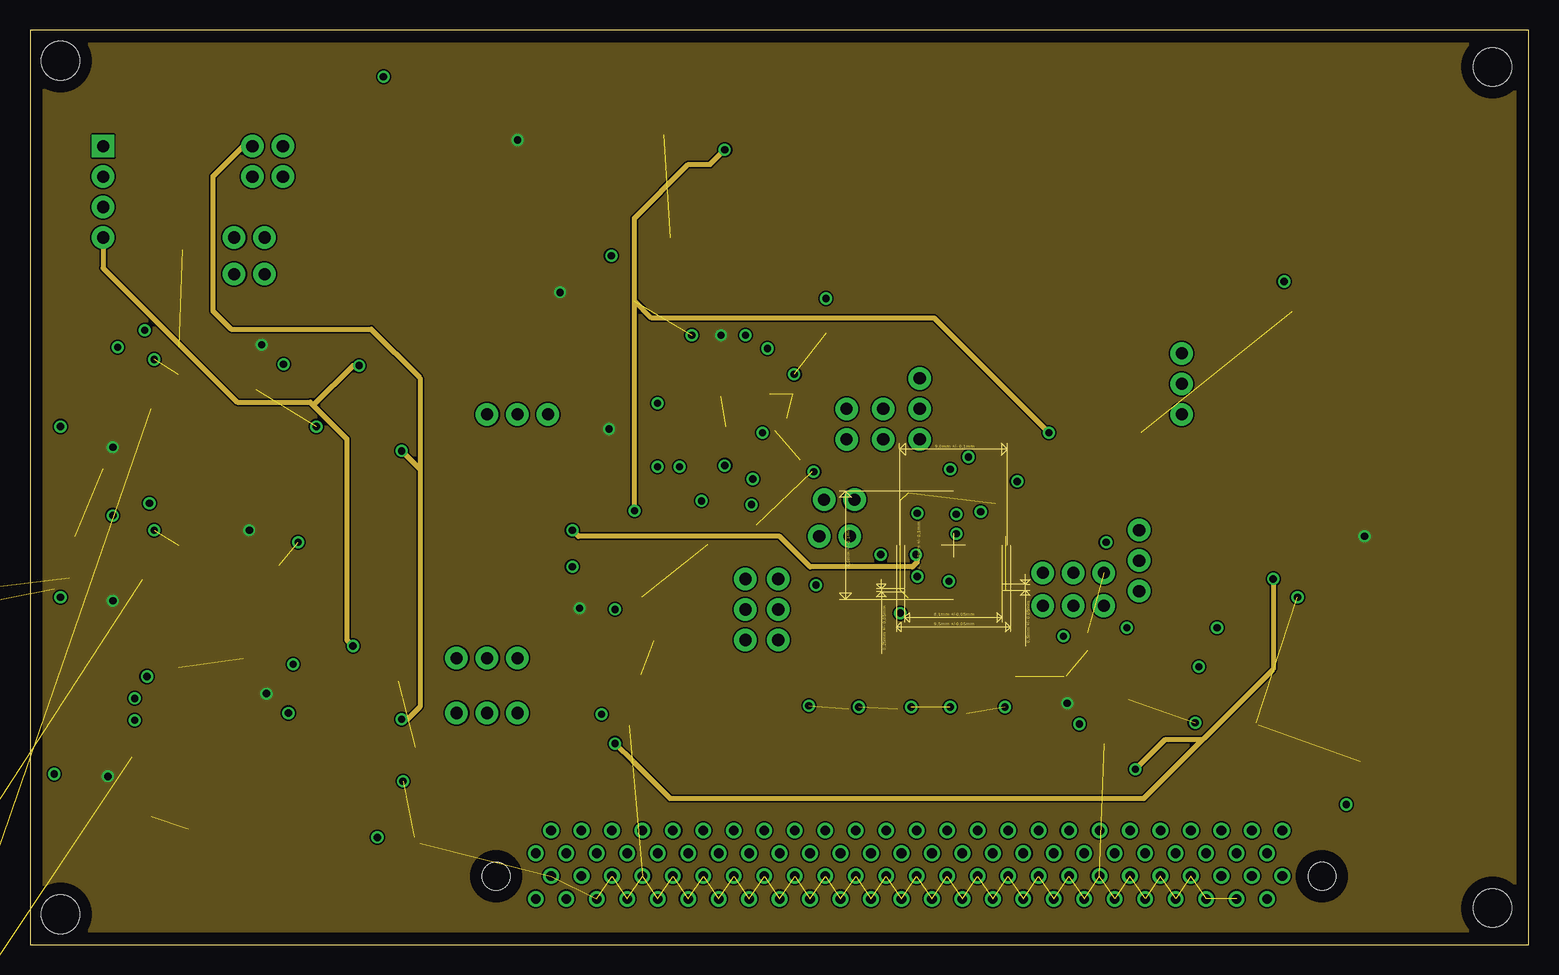
[diagram p7: board, inner layer Route3]
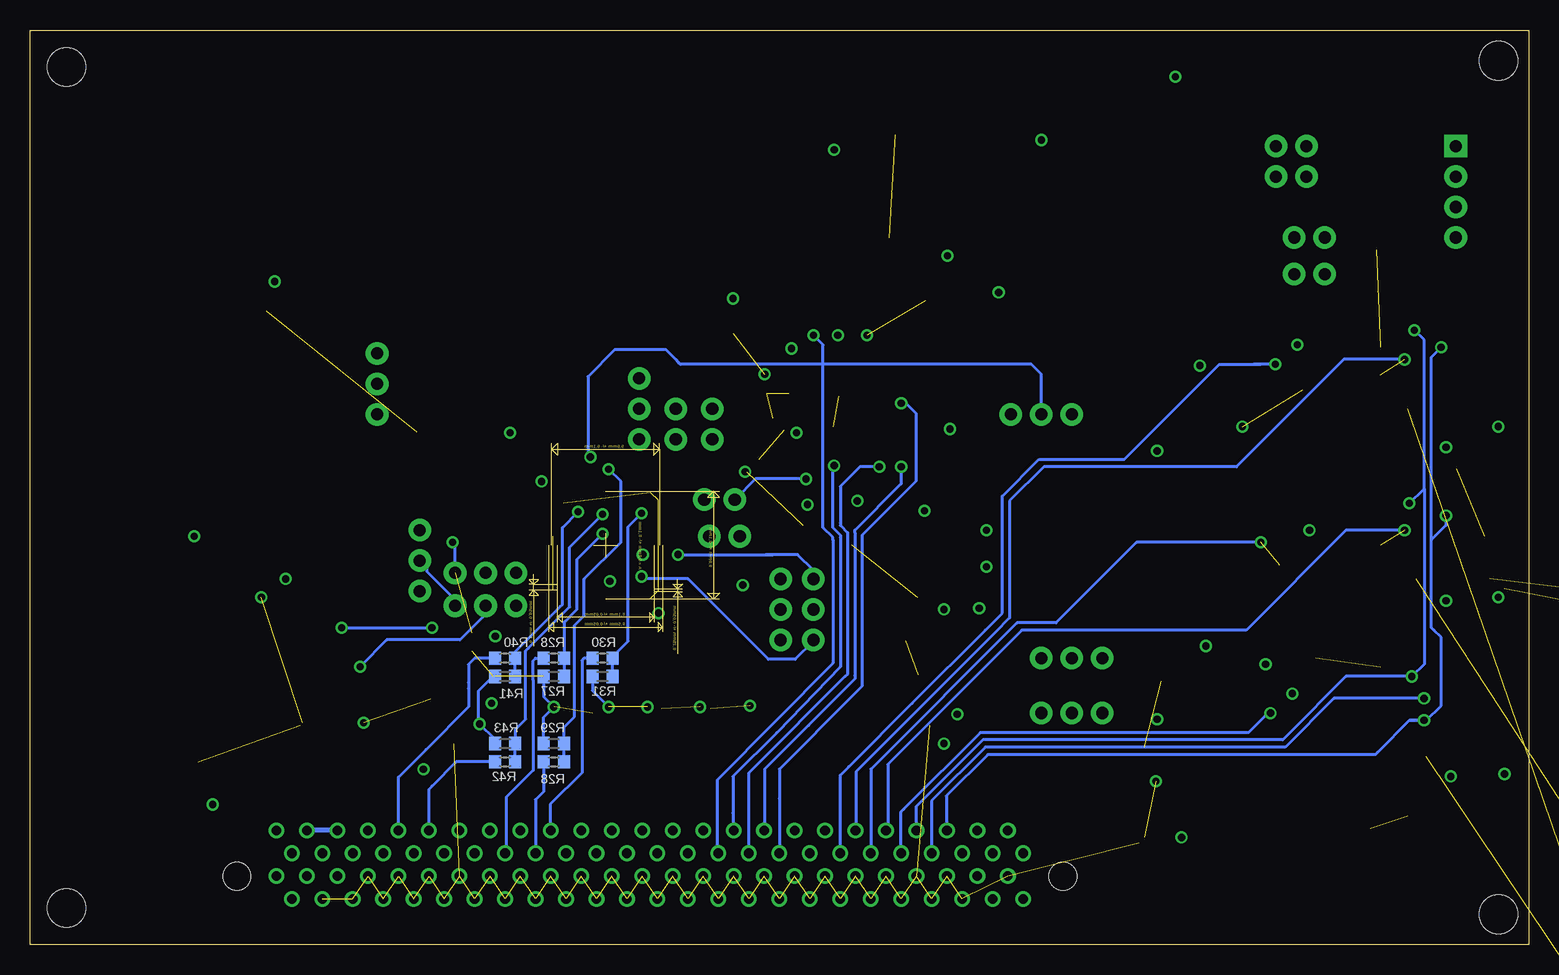
[diagram p8: board, bottom side, seen from below]

Size 124.95 x 76.23 mm. Coordinates in mm from the lower left corner, seen from the top.
Outline: 0,0 124.95,0 124.95,76.23 0,76.23 0,0
Copper layers [2:(1*2*3*16):3]: Top 0.035mm / dielectric 0.2mm / Route2 0.035mm / dielectric 0.15mm / Route3 0.035mm / dielectric 0.2mm / Bottom 0.035mm
Design rules "default *": minimum track width 10mil, minimum drill 24mil, track to track 5mil, track to pad 5mil, pad to pad 5mil, via to via 5mil, smd to smd 5mil, copper to edge 40mil, drill to drill 8mil, minimum pad ring 10mil, minimum via ring 8mil, stop-mask expansion 4mil, vias tented up to drill 0mil, thermal gap 10mil
Holes 3.2 mm at 2.54,2.54 121.92,3.05 2.54,73.66 121.92,73.15

### Footprints (pad centres in the part's own frame; a part is rotated, then mirrored left to right if it is on the bottom)
C0402 = smd 0.7 x 0.9: 1 -0.65,0; 2 0.65,0
C0805 = smd 1.3 x 1.5: 1 -0.95,0; 2 0.95,0
C0603 = smd 1.1 x 1: 1 -0.85,0; 2 0.85,0
QFN64 = smd 0.7 x 0.25: 1 -14.56,5.02; 2 -14.56,4.52; 3 -14.56,4.02; 4 -14.56,3.52; 5 -14.56,3.02; 6 -14.56,2.52; 7 -14.56,2.02; 8 -14.56,1.52; 9 -14.56,1.02; 10 -14.56,0.52; 11 -14.56,0.02; 12 -14.56,-0.48; 13 -14.56,-0.98; 14 -14.56,-1.48; 15 -14.56,-1.98; 16 -14.56,-2.48; 33 -5.76,-2.48; 34 -5.76,-1.98; 35 -5.76,-1.48; 36 -5.76,-0.98; 37 -5.76,-0.48; 38 -5.76,0.02; 39 -5.76,0.52; 40 -5.76,1.02; 41 -5.76,1.52; 42 -5.76,2.02; 43 -5.76,2.52; 44 -5.76,3.02; 45 -5.76,3.52; 46 -5.76,4.02; 47 -5.76,4.52; 48 -5.76,5.02 | smd 0.25 x 0.7: 17 -13.91,-3.13; 18 -13.41,-3.13; 19 -12.91,-3.13; 20 -12.41,-3.13; 21 -11.91,-3.13; 22 -11.41,-3.13; 23 -10.91,-3.13; 24 -10.41,-3.13; 25 -9.91,-3.13; 26 -9.41,-3.13; 27 -8.91,-3.13; 28 -8.41,-3.13; 29 -7.91,-3.13; 30 -7.41,-3.13; 31 -6.91,-3.13; 32 -6.41,-3.13; 49 -6.41,5.67; 50 -6.91,5.67; 51 -7.41,5.67; 52 -7.91,5.67; 53 -8.41,5.67; 54 -8.91,5.67; 55 -9.41,5.67; 56 -9.91,5.67; 57 -10.41,5.67; 58 -10.91,5.67; 59 -11.41,5.67; 60 -11.91,5.67; 61 -12.41,5.67; 62 -12.91,5.67; 63 -13.41,5.67; 64 -13.91,5.67
SC70 = smd 0.35 x 0.8: 1 -0.65,-0.95; 2 0,-0.95; 3 0.65,-0.95; 4 0.65,0.95; 5 0,0.95; 6 -0.65,0.95
SOT23-5L_2 = smd 0.55 x 1.2: 1 -0.95,-1.3; 2 0,-1.3; 3 0.95,-1.3; 4 0.95,1.3; 5 -0.95,1.3
SOT223 = smd 1.219 x 2.235: 1 -2.311,-3.099; 2 0,-3.099; 3 2.311,-3.099 | smd 3.6 x 2.2: 4 0,3.099
MSOP8 = smd 0.45 x 1: 1 -1.175,-1.875; 2 -0.525,-1.875; 3 0.125,-1.875; 4 0.775,-1.875; 5 0.775,2.225; 6 0.125,2.225; 7 -0.525,2.225; 8 -1.175,2.225
SOT23-8_2 = smd 0.406 x 0.813: 1 -1,-1.04; 2 -0.35,-1.04; 3 0.3,-1.04; 4 0.95,-1.04; 5 0.95,1.26; 6 0.3,1.26; 7 -0.35,1.26; 8 -1,1.26
QSOP16 = smd 0.4 x 1: 1 -2.223,-2.75; 2 -1.588,-2.75; 3 -0.953,-2.75; 4 -0.318,-2.75; 5 0.318,-2.75; 6 0.953,-2.75; 7 1.588,-2.75; 8 2.223,-2.75; 9 2.223,2.75; 10 1.588,2.75; 11 0.953,2.75; 12 0.318,2.75; 13 -0.318,2.75; 14 -0.953,2.75; 15 -1.588,2.75; 16 -2.223,2.75
TQFN12 = smd 1 x 0.3: P$1 0.05,-1.1; P$2 0.05,-2; P$3 0.05,-2.9; P$7 3.95,-2.9; P$8 3.95,-2; P$9 3.95,-1.1 | smd 0.3 x 1: P$4 1.1,-3.95; P$5 2,-3.95; P$6 2.9,-3.95; P$10 2.9,-0.05; P$11 2,-0.05; P$12 1.1,-0.05 | smd 2 x 2: P$13 2,-2
MSOP10 = smd 0.25 x 1: 1 -1,-2.113; 2 -0.5,-2.113; 3 0,-2.113; 4 0.5,-2.113; 5 1,-2.113; 6 1,2.113; 7 0.5,2.113; 8 0,2.113; 9 -0.5,2.113; 10 -1,2.113
FX2-100S-1.27 = drill 0.8: A1 0,0; A2 -1.27,-1.905; A3 -2.54,0; A4 -3.81,-1.905; A5 -5.08,0; A6 -6.35,-1.905; A7 -7.62,0; A8 -8.89,-1.905; A9 -10.16,0; A10 -11.43,-1.905; A11 -12.7,0; A12 -13.97,-1.905; A13 -15.24,0; A14 -16.51,-1.905; A15 -17.78,0; A16 -19.05,-1.905; A17 -20.32,0; A18 -21.59,-1.905; A19 -22.86,0; A20 -24.13,-1.905; A21 -25.4,0; A22 -26.67,-1.905; A23 -27.94,0; A24 -29.21,-1.905; A25 -30.48,0; A26 -31.75,-1.905; A27 -33.02,0; A28 -34.29,-1.905; A29 -35.56,0; A30 -36.83,-1.905; A31 -38.1,0; A32 -39.37,-1.905; A33 -40.64,0; A34 -41.91,-1.905; A35 -43.18,0; A36 -44.45,-1.905; A37 -45.72,0; A38 -46.99,-1.905; A39 -48.26,0; A40 -49.53,-1.905; A41 -50.8,0; A42 -52.07,-1.905; A43 -53.34,0; A44 -54.61,-1.905; A45 -55.88,0; A46 -57.15,-1.905; A47 -58.42,0; A48 -59.69,-1.905; A49 -60.96,0; A50 -62.23,-1.905; B1 0,3.8; B2 -1.27,1.895; B3 -2.54,3.8; B4 -3.81,1.895; B5 -5.08,3.8; B6 -6.35,1.895; B7 -7.62,3.8; B8 -8.89,1.895; B9 -10.16,3.8; B10 -11.43,1.895; B11 -12.7,3.8; B12 -13.97,1.895; B13 -15.24,3.8; B14 -16.51,1.895; B15 -17.78,3.8; B16 -19.05,1.895; B17 -20.32,3.8; B18 -21.59,1.895; B19 -22.86,3.8; B20 -24.13,1.895; B21 -25.4,3.8; B22 -26.67,1.895; B23 -27.94,3.8; B24 -29.21,1.895; B25 -30.48,3.8; B26 -31.75,1.895; B27 -33.02,3.8; B28 -34.29,1.895; B29 -35.56,3.8; B30 -36.83,1.895; B31 -38.1,3.8; B32 -39.37,1.895; B33 -40.64,3.8; B34 -41.91,1.895; B35 -43.18,3.8; B36 -44.45,1.895; B37 -45.72,3.8; B38 -46.99,1.895; B39 -48.26,3.8; B40 -49.53,1.895; B41 -50.8,3.8; B42 -52.07,1.895; B43 -53.34,3.8; B44 -54.61,1.895; B45 -55.88,3.8; B46 -57.15,1.895; B47 -58.42,3.8; B48 -59.69,1.895; B49 -60.96,3.8; B50 -62.23,1.895 | hole 2.3: -65.54,1.905; 3.31,1.905
1X03 = drill 1.016 pad 1.88: 1 -2.54,0; 2 0,0; 3 2.54,0
1X02 = drill 1.016 pad 1.88: 1 -1.27,0; 2 1.27,0
1X04 = drill 1.016 pad 1.88 square: 1 0,0 | drill 1.016 pad 1.88: 2 2.54,0; 3 5.08,0; 4 7.62,0
ST-5EW = smd 1.4 x 2: 1 -2.5,-2.6; 2 0,2.6; 3 2.5,-2.6
R0603 = smd 1 x 1.1: 1 -0.85,0; 2 0.85,0
TP = smd 3.81 x 2.032: TP 0,0

### Placement (x,y rotation side)
C1  4.57,28.45 180 top
C2  4.57,13.72 180 top
C3  4.57,42.67 180 top
C4  45.21,52.32 270 top
C5  52.32,33.02 90 top
C6  83.31,35.05 270 top
C7  87.48,41.76 270 top
C8  90.42,18.29 180 top
C9  85.34,35.05 270 top
C10  86.87,35.05 270 top
C11  70.21,29.97 270 top
C12  68.38,29.97 270 top
C13  66.85,29.97 270 top
C14  90.42,16.76 180 top
C15  89.92,21.34 270 top
C16  88.39,21.34 270 top
C17  89,24.49 180 top
C18  89,26.01 180 top
C19  49.28,24.89 90 top
C20  47.75,24.89 90 top
C21  50.8,19.81 180 top
C22  50.8,18.29 180 top
C23  51.82,27.43 180 top
C24  51.82,28.96 180 top
C25  110.74,31.5 270 top
C26  4.57,48.26 180 top
C27  4.57,34.04 180 top
C28  50.29,52.83 90 top
C29  105.66,31.5 270 top
C30  -5.59,28.04 180 top  (outside the outline)
C31  -5.59,33.12 180 top  (outside the outline)
C32  31.5,23.37 270 top
C33  33.02,17.27 270 top
C34  32,45.21 270 top
C35  4.57,19.3 180 top
C36  69.29,47.04 0 top
C37  69.29,48.56 0 top
C38  76.61,43.18 270 top
C39  56.9,48.77 0 top
C40  47.24,33.02 270 top
C41  92.56,41.76 90 top
C42  111.76,15.24 180 top
C43  31.5,70.61 90 top
C44  40.64,70.61 90 top
C45  48.26,70.61 90 top
C46  57.4,70.61 90 top
C47  25.91,21.34 270 top
C48  23.88,21.34 90 top
C49  25.4,45.21 270 top
C52  56.69,45.72 0 top
C53  56.9,47.24 180 top
C54  67.87,39.12 180 top
C55  61.37,34.95 180 top
C56  65.61,44.7 270 top
C57  65.53,50.9 0 top
IC1  75.69,23.11 270 top
IC2  19.81,46.23 270 top
IC3  19.81,30.99 270 top
IC4  19.81,17.27 270 top
IC5  4.57,45.72 270 top
IC6  4.57,31.5 270 top
IC7  4.57,16.76 270 top
IC8  47.75,52.83 180 top
IC9  52.83,70.61 0 top
IC10  49.78,33.02 0 top
IC11  36.07,70.61 0 top
IC12  28.45,21.34 180 top
IC13  90.02,41.76 180 top
IC14  28.45,44.2 180 top
IC16  108.2,31.5 0 top
IC17  -5.59,30.58 270 top  (outside the outline)
IC18  12.7,48.77 180 top
IC19  12.7,34.54 180 top
IC20  12.7,19.81 180 top
IC21  61.98,43.18 0 top
IC22  95.5,23.37 270 top
IC23  55.88,43.18 90 top
J1  42.16,7.62 180 top
JP1  74.17,44.65 270 top
JP2  18.29,58.93 0 top
JP3  62.38,27.94 90 top
JP4  96.01,46.74 270 top
JP5  19.81,66.55 180 top
JP6  18.29,55.88 180 top
JP7  40.64,44.2 0 top
JP8  19.81,64.01 180 top
JP9  68.07,43.38 270 top
JP10  71.12,43.38 270 top
JP11  67.46,37.08 0 top
JP12  67.06,34.04 0 top
JP13  86.97,28.24 180 top
JP14  86.97,30.99 180 top
JP15  38.1,23.88 0 top
JP16  38.1,19.3 0 top
JP17  6.1,66.55 270 top
JP18  59.64,27.94 90 top
JP19  92.46,32 270 top
R1  102.62,42.67 90 top
R2  102.62,50.29 90 top
R3  92.96,12.7 180 top
R4  12.7,42.16 270 top
R5  12.7,27.94 270 top
R6  12.7,13.21 270 top
R7  53.85,15.75 270 top
R8  111.76,13.21 0 top
R9  32.51,7.62 270 top
R14  73.15,15.24 180 top
R15  73.15,16.76 0 top
R16  77.22,15.24 0 top
R17  77.22,16.76 180 top
R18  77.22,23.88 0 top
R19  77.22,22.35 180 top
R20  81.28,15.24 0 top
R21  81.28,16.76 180 top
R22  81.28,23.88 0 top
R23  81.28,22.35 180 top
R24  85.34,15.24 0 top
R25  85.34,16.76 180 top
R26  81.28,23.88 180 bottom
R27  81.28,22.35 0 bottom
R28  81.28,15.24 180 bottom
R29  81.28,16.76 0 bottom
R30  77.22,23.88 180 bottom
R31  77.22,22.35 0 bottom
R32  65.02,15.24 180 top
R33  65.02,16.76 0 top
R34  73.15,23.88 180 top
R35  73.15,22.35 0 top
R36  69.09,15.24 180 top
R37  69.09,16.76 0 top
R38  69.09,23.88 180 top
R39  69.09,22.35 0 top
R40  85.34,23.88 180 bottom
R41  85.34,22.35 0 bottom
R42  85.34,15.24 180 bottom
R43  85.34,16.76 0 bottom
TP1  25.91,68.58 0 top
TP2  12.7,68.58 0 top
TP3  25.91,62.99 0 top
TP4  12.7,62.99 0 top
TP5  44.2,68.58 0 top
TP6  60.96,68.58 0 top
TP7  95.61,38.4 180 top
TP8  47.4,36.53 0 top
TP9  96.72,29.36 0 top
TP10  96.72,34.54 0 top
TP11  30.89,29.06 0 top
TP12  44.7,14.73 0 top
TP13  25.4,13.72 0 top
TP14  37.59,14.73 0 top
TP15  53.54,55.58 0 top
TP16  102.11,32.51 0 top
TP17  -5.99,35.36 0 top  (outside the outline)
TP18  12.7,57.91 0 top
TP19  25.91,58.42 0 top
TP20  77.22,51.31 90 top
TP21  80.26,51.31 90 top
TP22  89.92,46.33 0 top
TP23  47.55,40.44 0 top
TP24  19.81,39.62 0 top
TP25  21.34,27.94 0 top
TP26  20.32,13.72 0 top
TP27  109.22,42.67 0 top
TP28  100.08,56.9 0 top
TP29  25.91,54.86 0 top
TP30  24.38,49.78 0 top
TP31  53.34,58.93 0 top
TP32  45.11,20.73 90 top
TP33  102.41,18.29 0 top
TP34  24.89,39.62 0 top
TP35  17.78,23.88 0 top
TP36  16.26,7.11 0 top
TP37  38.61,39.62 0 top
TP38  56.49,33.32 0 top
TP39  102.41,25.2 0 top
TP40  38.4,29.06 0 top
TP41  -5.89,-1.42 0 top  (outside the outline)
TP42  -7.52,4.47 0 top  (outside the outline)
TP43  -5.89,-5.89 0 top  (outside the outline)
U$5  54.86,25.4 270 top

### Tracks (layer width: path | path; a pad name or v marks a point on that pad's centre or on a via)
!CS_ADC1
  Top 0.254: IC22.P$9 94.4,15.12 96.72,12.8 96.72,9.58 J1.A44
!CS_ADC2
  Top 0.254: U$5.P$9 53.76,20.61 59.94,14.43 J1.A15
!CS_DAC  (via drill 0.6)
  Top 0.254: IC23.7 53.15,43.68 52.32,44.5 v52.32,45.11
  Bottom 0.254: v52.32,45.11 51.92,45.11 51.1,44.3 51.1,38.61 55.17,34.54 55.58,34.14 55.58,21.95 55.58,21.54 56.39,20.73 62.48,14.63 62.48,12.19 J1.A17
ADC1_IN+  (via drill 0.6)
  Top 0.254: IC22.P$12 96.54,22.27 v97.43,23.16
  Bottom 0.254: JP13.2 86.97,27.53 89.1,25.4 95.2,25.4 v97.43,23.16
ADC1_IN-
  Top 0.254: JP14.2 87.17,30.99 88.49,29.67 90.12,29.67 91.95,27.84 94.4,25.38 IC22.P$1
ADC2_IN+
  Top 0.254: JP3.2 61.47,27.94 60.96,27.43 60.96,24.38 60.45,23.88 60.35,23.77 59.13,23.77 58.61,24.3 U$5.P$12
ADC2_IN-
  Top 0.254: JP18.2 55.17,27.94 53.85,26.62 53.76,26.54 U$5.P$1
AGND  (via drill 0.6)  (6 unrouted)
  Top 0.254: IC1.48 IC1.49 | 89.92,43.16 IC13.2
  Top 0.406: JP6.2 17.17,56.03 17.17,56.69 19.41,58.93 JP2.2 20.07,58.42 TP19.TP | C10.2 C9.2 85.24,34.1 C6.2 83.23,34.02 IC1.58 80.78,34.02 80.47,34.34 80.47,36.78 80.71,37.02 IC1.1 IC1.64 82.95,37.02 | IC13.2 90.02,42.27 90.27,42.01 | 90.27,42.01 90.53,41.76 91.71,41.76 C41.2 92.66,42.71 | C7.2 88.35,41.11 89,41.76 90.02,41.76 | 90.02,41.76 90.27,42.01 | 82.95,37.02 87.42,37.02 89.51,39.12 90.02,39.62 90.02,41.76 | v82.3,38.61 82.3,37.67 82.95,37.02 | TP22.TP 89.92,43.16 | R2.3 105.22,54.6 v104.55,55.27
  Route2 0.406: v82.3,38.61 81.79,39.12 81.79,47.24 70.1,58.93 JP2.2 | JP2.2 19.41,58.93 18.85,58.37 19,58.37 JP2.2
AVDD
  Top 0.406: C10.1 85.85,35.9 | 85.85,35.9 C9.1 | IC1.62 83.29,36.02 C6.1 85.75,36 | 85.75,36 85.85,35.9 | C41.1 91.42,40.91 IC13.5 91.03,40.39 91.03,39.42 90.83,39.22 | 85.75,36 87.61,36 90.83,39.22 | 91.44,38.61 91.24,38.81 | 91.24,38.81 90.83,39.22 | R1.1 93.61,40.17 92.05,38.61 91.85,38.41 | TP7.TP 91.85,38.41 | 91.85,38.41 91.64,38.41 91.24,38.81
BASELINE
  Top 0.254: IC1.56 87.79,33.02 89.31,34.54 JP19.1 TP10.TP
CAP_PRECHAR
  Top 0.254: IC1.14 74.21,38.85 74.98,39.62 76.61,41.25 C38.2 77.89,42.33 78.23,42.67 78.23,46.23 80.26,48.26 TP21.TP
CAP_PRECHAR_1
  Top 0.254: JP1.1 74.17,47.75 72.34,49.58 65.23,49.58 65.02,49.58 | IC21.12 62.28,45.94 62.28,47.65 64.21,49.58 65.02,49.58 | C57.1 64.68,49.92 65.02,49.58
CLK  (via drill 0.6)
  Top 0.254: IC1.20 73.52,35.52 v73.97,35.97
  Bottom 0.254: R30.1 R31.2 76.37,24.02 75.29,25.09 75.08,25.3 75.08,34.85 v73.97,35.97
CLK_ADC1
  Top 0.254: IC22.P$10 95.45,15.29 98.15,12.6 98.15,7.72 J1.A45
CLK_ADC2
  Top 0.254: U$5.P$10 54.81,20.88 60.96,14.73 61.21,14.48 J1.A16
CLK_DAC  (via drill 0.6)
  Top 0.254: v54.15,39.83 54.15,41.79 IC23.10
  Bottom 0.254: v54.15,39.83 55.78,39.83 57.4,38.2 57.4,35.15 57.4,34.95 56.79,34.34 56.79,22.76 56.79,22.55 57,22.35 64.77,14.58 65.02,14.33 J1.A19
CLK_PRECH1  (via drill 0.6)
  Top 0.254: IC1.9 76.71,37.08 76.91,36.88 78.44,36.88 v79.25,36.07
  Bottom 0.254: v79.25,36.07 80.57,34.75 80.57,28.35 80.77,28.14 84.49,24.42 R40.1 R41.2
CLK_PRECH1_T
  Bottom 0.254: 88.39,21.84 88.39,21.34 | 88.39,21.34 88.39,19.81 91.95,16.26 94.23,13.97 J1.A42 | R40.2 87.88,23.88 88.39,23.37 88.39,21.34
CLK_PRECH2  (via drill 0.6)
  Top 0.254: IC1.10 76.21,36.87 v77.22,35.87
  Bottom 0.254: v77.22,35.87 79.96,33.12 79.96,28.14 83.41,24.69 83.62,24.49 83.62,18.8 84.49,17.92 R43.2 R42.1
CLK_PRECH2_T
  Bottom 0.254: R42.2 89.41,15.24 91.44,13.21 91.69,12.95 J1.A40
CLK_REF  (via drill 0.6)
  Top 0.254: IC20.4 11.25,20.85 v9.75,22.35 | IC18.4 10.95,49.81 v9.55,51.21 | IC19.4 11.15,35.58 v9.96,36.78
  Bottom 0.254: J1.A8 51.05,11.53 51,11.58 45.52,17.07 20.52,17.07 20.12,17.48 15.24,22.35 v9.75,22.35 8.74,23.37 8.74,38 | 8.74,38 v9.96,36.78 8.74,38 | 8.74,38 8.74,50.39 v9.55,51.21
CLK_T
  Bottom 0.254: R30.2 78.74,23.88 78.94,23.67 78.94,14.33 81.58,11.68 81.58,9.58 J1.A32
CS_B0
  Top 0.254: R14.1 R15.2 74,17.11 74.88,17.98 74.88,24.89 77.11,27.13 77.21,27.23 IC1.41
CS_B0_T
  Top 0.254: J1.A26 73.91,12.65 72.24,14.33 72.24,15.18 R14.2
CS_B1
  Top 0.254: R16.1 R17.2 75.49,17.64 75.49,24.69 77.71,26.91 IC1.42
CS_B1_T
  Top 0.254: J1.A28 76.45,11.63 78.13,13.31 78.13,15.18 R16.2
CS_B2
  Top 0.254: IC1.43 78.21,25.79 77.72,25.3 76.5,24.08 76.37,23.94 R18.1 R19.2
CS_B2_T
  Top 0.254: J1.A30 78.94,9.58 78.94,21.84 78.94,23.67 78.74,23.88 R18.2
CS_B3
  Top 0.254: R20.1 R21.2 80.26,16.93 80.26,18.29 79.55,19 79.55,24.28 79.35,24.49 78.71,25.12 IC1.44
CS_B3_T
  Top 0.254: J1.A34 84.07,11.94 82.3,13.72 82.3,15.07 R20.2
CS_B4
  Top 0.254: IC1.45 79.21,25.44 80.26,24.38 80.26,24.04 R22.1 R23.2
CS_B4_T
  Top 0.254: J1.A36 86.61,10.92 85.85,11.68 83.31,14.22 83.31,18.29 83.31,20.32 83.31,21.84 83.31,23.37 82.8,23.88 R22.2
CS_B5
  Top 0.254: R24.1 R25.2 84.43,16.76 83.82,17.37 83.82,23.88 83.52,24.18 81.79,25.91 79.71,27.98 IC1.46
CS_B5_T
  Top 0.406: J1.A38 89.15,10.92 86.36,13.72 86.36,15.07 R24.2
CS_REF_1  (via drill 0.6)  (1 unrouted)
  Bottom 0.254: v10.36,48.77 15.44,48.77 23.98,40.23 24.38,39.83 40.44,39.83 43.28,36.98 43.28,27.23 44.5,26.01 56.08,14.43 56.08,9.58 J1.A12
CS_REF_2  (via drill 0.6)  (1 unrouted)
  Bottom 0.254: v10.36,34.54 15.24,34.54 23.57,26.21 42.27,26.21 53.44,15.04 53.44,9.68 J1.A10
CS_REF_3  (via drill 0.6)
  Top 0.254: IC20.6 12.4,19.3 11.99,19.71 9.55,19.71 v8.74,20.52
  Bottom 0.254: v8.74,20.52 16.26,20.52 20.32,16.46 45.31,16.46 49.78,11.99 J1.A7
DGND  (via drill 0.6)
  Top 0.254: IC1.28 72.53,31.5 71.93,31.5 71.32,30.89 71.32,30.07 70.27,29.02 C11.2 68.48,29.02 C12.2 C13.2 66,29.97 v65.53,29.97 | v45.21,31.5 46.33,31.5 | 46.33,31.5 46.57,31.5 C40.2 | 46.33,31.5 43.48,34.34 43.48,38.61 44.91,40.03 45.31,40.44 TP23.TP
  Top 0.406: C40.2 47.41,32.17 48.26,33.02 49.28,33.02 49.78,32.51 | 49.78,32.51 IC10.2 | C5.2 51.96,33.67 51.31,33.02 50.29,33.02 49.78,32.51 | TP29.TP 20.57,54.86 JP6.1
  Route2 0.406: v65.53,29.97 62.48,33.02 45.72,33.02 45.21,32.51 v45.21,31.5 44.81,31.9 40.44,31.9 34.54,37.8 34.54,45.52 24.18,55.88 JP6.1
DVDD  (via drill 0.6)
  Top 0.254: C13.1 C12.1 70.11,30.82 C11.1 70.78,31.5 71.12,31.5 71.65,32.02 IC1.27 73.33,32.02 73.82,32.51 v73.86,32.51 | IC10.5 48.83,35.09 TP8.TP | v45.21,34.54 46.57,34.54 C40.1
  Top 0.406: C40.1 48.38,33.87 IC10.5
  Route3 0.406: v45.21,34.54 45.72,34.04 62.48,34.04 65.02,31.5 73.56,31.5 73.97,31.9 73.97,32.41 v73.86,32.51
GND  (via drill 0.6)  (75 unrouted)
  Top 0.254: IC18.3 12.4,49.37 13.51,48.26 | 13.51,48.26 13.61,48.16 | IC18.8 13.7,48.07 13.51,48.26 | C52.2 57.54,45.75 C53.2 C39.1 56.05,49.92 v55.17,50.8 | IC19.3 12.4,34.95 12.5,34.85 13.01,34.34 13.41,34.34 13.7,34.05 13.7,33.65 IC19.8 14.47,33.28 16.76,30.99 IC3.2 | IC20.3 12.4,20.11 12.5,20.02 13.01,19.51 13.41,19.51 13.61,19.3 13.7,19.22 13.7,18.81 IC20.8 15.99,18.55 17.17,17.37 17.27,17.27 IC4.2 15.24,17.27 13.21,15.24 13.21,9.65 15.75,7.11 TP36.TP | C16.2 C15.2 | R8.1 110.91,12.87 v109.73,11.68 | 81.79,19.3 82.13,19.65 R27.1 | 81.79,19.3 v81.28,19.81 | R29.1 82.13,18.96 81.79,19.3 | 78.07,19.3 R17.1 | R15.1 72.3,17.84 72.3,18.66 72.8,19.15 | R31.1 78.07,19.3 | 78.07,19.3 77.22,19.3 v76.71,19.81 | 72.8,19.15 v73.46,19.81 | R35.1 72.3,19.65 72.8,19.15 | R37.1 68.24,18.96 68.58,19.3 | 68.58,19.3 v69.09,19.81 | R39.1 68.24,19.65 68.58,19.3 | v23.88,43.18 23.88,40.64 TP34.TP | C32.2 31.26,22.52 30.68,21.95 27.37,21.95 C47.2 25.77,20.62 25.3,20.62 23.88,22.05 C48.2 23.84,22.15 22.76,22.15 21.95,22.96 v21.95,23.37 21.44,23.88 TP35.TP | C21.2 C22.2 | C19.2 C20.2 | C23.2 51.31,27.43 C23.2 | C23.2 50.8,27.43 | 50.8,27.43 50.8,28.79 C24.2 | U$5.P$3 51.96,26.43 C23.2 | v48.77,27.94 48.77,26.25 C19.2 | 50.8,27.43 50.8,27.27 C19.2 | U$5.P$6 50.91,20.78 C21.2 | C14.2 C8.2 | C15.2 89.92,20.32 91.41,20.32 IC22.P$6 | C18.2 C17.2 89.32,23.32 89.97,23.32 IC22.P$3 | IC23.3 60.55,43.18 v61.06,42.67 61.27,42.88 62.08,42.88 63.06,43.85 C56.2 | IC21.10 63.56,47.41 v63.7,47.55 | IC21.8 65.21,39.42 v65.33,39.42 66.71,39.42 C54.2 | IC21.13 61.66,49.49 v61.47,49.68 | R33.1 64.17,19.16 v64.92,19.91 | v97.13,18.49 102.21,18.49 TP33.TP
  Top 0.254: C21.2 48.26,19.81 v47.65,19.2 | v31.09,13.61 31.09,15.44 32.11,16.46 32.98,16.46 C33.2 | R43.1 87.07,16.76 87.68,16.76 88.59,17.68 88.59,18.09 88.8,18.29 | 88.8,18.29 88.59,18.29 88.49,18.39 87.88,18.39 v87.48,18.39 | 88.8,18.29 C8.2 | C8.2 89.57,20.14 C15.2
  Top 0.305: IC5.2 4.27,45.72 4.47,45.92 4.47,47.51 C26.2
  Top 0.406: IC11.2 36.07,68.58 34.8,69.85 | 34.8,69.85 33.53,71.12 31.84,71.12 C43.2 30.62,72.34 v29.46,72.34 | 34.8,69.85 36.41,71.46 C44.2 40.64,72.14 41.25,72.75 46.98,72.75 C45.2 48.43,71.63 50.29,71.63 52.07,69.85 | IC9.2 52.83,69.09 52.07,69.85 | C46.2 53.68,71.46 52.07,69.85 | JP17.3 9.65,61.47 11.18,59.94 13.21,59.94 | 13.21,59.94 16,59.94 JP2.1 | TP18.TP 12.7,59.44 13.21,59.94 | IC5.2 2.03,45.72 2.03,43.69 v2.54,43.18 3.41,43.18 C3.2 4.06,42.53 4.06,41.66 6.06,39.66 R4.3 | C27.2 4.57,33.19 4.57,32 4.06,31.5 IC6.2 2.44,31.5 2.03,31.09 2.03,29.67 2.54,29.16 v2.54,28.96 3.05,28.45 C1.2 3.92,27.07 5.59,25.4 10.06,25.4 R5.3 12.4,23.14 IC20.3 | C35.2 3.72,19.14 4.57,18.29 4.57,17.27 4.06,16.76 IC7.2 2.54,16.76 2.03,16.26 v2.03,14.22 3.41,14.22 C2.2 4.06,13.57 4.06,12.19 5.55,10.71 R6.3 | IC18.8 14.83,47.51 | 14.83,47.51 15.89,47.51 17.07,46.33 17.17,46.23 IC2.2 | R4.3 10.1,41.39 14.22,45.52 14.22,46.9 14.83,47.51 | R4.3 10.1,39.18 12.19,37.08 12.4,36.88 IC19.3 | v23.88,43.18 25.06,44.36 C49.2 C34.2 | C42.2 R8.1 | 48.06,52.83 49.28,52.83 50.13,53.68 C28.2 50.29,55.88 48.77,57.4 v48.46,57.4 51.82,57.4 TP31.TP | 48.06,52.83 47.85,53.03 47.75,53.14 IC8.2 | C25.2 110.74,29.46 110.24,28.96 108.71,28.96 108.2,29.46 IC16.2 108.2,31.5 106.68,31.5 105.83,30.65 C29.2 v105.66,28.96 | v66.34,53.85 66.34,50.94 C57.2 | C55.2 59.64,34.95 58.01,34.95 | C4.2 45.21,50.8 45.72,50.29 45.82,50.19 47.24,50.19 48.06,51 48.06,52.83 | C18.2 86.46,26.01 v86.16,25.7 | v28.96,8.94 32.04,8.94 R9.1 | 58.01,34.95 v55.98,36.98 | 58.01,34.95 58.01,34.85 TP38.TP | TP32.TP 46.13,20.73 v47.65,19.2
  Bottom 0.254: R29.1 82.13,17.95 82.13,18.96 v81.28,19.81 82.13,20.66 R27.1 | R31.1 78.07,21.17 v76.71,19.81 | JP14.1 89.51,33.33 v89.71,33.53 | R41.1 86.36,22.35 87.58,21.13 87.58,19.71 87.58,18.49 v87.48,18.39 86.19,17.11 R43.1
  pour Route2: 0,76.2 124.97,76.2 124.97,0 0,0
HOLD
  Top 0.254: R39.2 R38.1 69.94,24.83 70.92,25.81 73.36,25.81 75.18,27.64 75.21,27.66 75.21,27.87 IC1.37
HOLD_T
  Top 0.254: R38.2 67.77,23.88 67.36,23.47 67.36,13.72 70,11.07 70,7.72 J1.A23
MUX_DAC_EN  (via drill 0.6)
  Top 0.254: IC21.15 60.39,50.05 v59.64,50.8
  Bottom 0.254: v59.64,50.8 58.93,50.09 58.83,49.99 58.83,34.75 58.01,33.93 58.01,33.73 58.01,23.47 67.67,13.72 67.67,10.97 67.67,7.72 J1.A21
MUX_DAC_SEL  (via drill 0.6)
  Top 0.254: IC21.1 58.41,40.43 v57.91,39.93
  Bottom 0.254: J1.A20 66.34,9.58 66.34,10.97 66.34,14.02 62.69,17.68 57.4,23.16 57.4,33.93 57.4,34.14 58.01,34.75 58.01,39.83 v57.91,39.93
MUX_REF_1  (via drill 0.6)
  Top 0.254: IC2.6 20.76,47.99 v21.13,48.36
  Bottom 0.254: v21.13,48.36 22.35,48.36 | 22.35,48.36 22.96,48.36 | 22.35,48.36 25.81,48.36 33.73,40.44 40.84,40.44 43.89,37.39 43.89,27.64 45.31,26.21 51.41,20.12 56.69,14.83 57.4,14.12 J1.A13
MUX_REF_2  (via drill 0.6)  (1 unrouted)
  Bottom 0.254: v22.35,33.53 32.72,33.53 39.42,26.82 42.67,26.82 54.86,14.63 J1.A11
MUX_REF_3  (via drill 0.6)
  Top 0.254: IC4.6 20.76,18.53 v21.54,19.3
  Bottom 0.254: v21.54,19.3 21.74,19.3 23.37,17.68 45.72,17.68 52.12,11.28 52.32,11.07 J1.A9
N$1
  Top 0.254: JP9.2 68.07,42.67 69.49,44.09 69.49,46.39 C36.2 | 70.45,46.94 C36.2 | C36.2 70.17,47.04 | C37.1 68.62,48.56 C36.2
N$2
  Top 0.406: R9.2 32.51,4.57 33.53,3.56 34.85,2.23 40.64,2.23 41.9,3.5 41.9,3.56 J1.B1
N$3
  Top 0.254: JP10.1 71.12,47.79 70.34,48.56 C37.2
N$4
  Bottom 0.406: J1.A46 J1.A48
N$5
  Top 0.254: IC4.1 17.64,17.92 14.73,20.83 13.72,20.83 IC20.1
N$6
  Top 0.254: JP1.2 75.98,44.65 C38.1
N$9
  Bottom 0.254: JP13.1 89.51,28.75 91.85,31.09 91.85,31.39 JP19.2
N$10
  Top 0.406: J1.B50 104.39,7.06 105.56,8.23 109.73,8.23 112.61,11.11 R8.2 C42.1
N$17
  Top 0.254: IC18.1 15.93,49.81 IC2.1
N$19
  Top 0.254: IC19.1 14,35.58 17.98,31.6 18.82,31.6 IC3.1
OP_MODE  (via drill 0.6)
  Top 0.254: IC1.11 75.71,35.74 v77.22,34.24
  Bottom 0.254: v77.22,34.24 79.35,32.11 79.35,27.94 79.55,27.74 80.31,26.98 80.43,26.86 R26.1 R27.2
OP_MODE_T
  Bottom 0.254: J1.A35 85.24,7.72 85.24,12.29 83.01,14.53 83.01,22.05 83.01,23.67 82.8,23.88 R26.2
OUT_S
  Top 0.254: R32.1 R33.2 66.34,17.23 66.34,18.93 66.34,23.88 68.89,26.42 73.15,26.42 73.56,26.82 74.21,27.48 74.21,27.68 IC1.35
OUT_S_T
  Top 0.254: J1.A22 68.83,11.02 66.75,13.11 64.72,13.11 64.17,13.65 R32.2
POT_R1
  Top 0.254: R1.2 102.72,42.67 103.07,43.03 | 103.07,43.03 R1.3 | JP4.3 98.49,44.2 R1.2 | 100.08,42.61 R1.2 | TP27.TP 103.43,42.67 103.07,43.03
POT_R2
  Top 0.254: 98.55,50.29 R2.2 101.6,50.29 104.1,47.79 R2.1 | 98.55,50.29 97.03,50.29 JP4.1 | TP28.TP 100.08,54.86 98.04,52.83 98.04,50.8 98.55,50.29
POT_R4
  Top 0.254: IC2.3 18.8,45.52 17.48,45.52 15.3,43.34 R4.2 17.58,42.16 17.88,41.86 19.81,39.93 TP24.TP
POT_R5
  Top 0.254: R5.2 15.3,28.51 17.17,30.38 | 17.17,30.38 18.82,30.38 IC3.3 | TP25.TP 19.81,27.74 17.17,30.38
POT_R6
  Top 0.254: R6.2 15.3,14.89 16.97,16.56 18.8,16.56 IC4.3 18.86,15.17 TP26.TP
REF_ADC  (1 unrouted)
REF_ADC1  (via drill 0.6)
  Top 0.254: C18.1 C17.1 90.16,24.79 91.38,24.79 92.05,24.79 | 92.05,24.79 92.35,24.79 93.07,24.79 93.5,24.35 93.5,23.64 IC22.P$2 | v91.44,26.42 91.44,25.4 92.05,24.79 | TP39.TP 100.18,25.2 v98.96,26.42
  Bottom 0.254: v98.96,26.42 v91.44,26.42
REF_ADC2
  Top 0.254: 52.86,27.23 C23.1 | C23.1 C24.1 52.63,28.99 52.63,29.67 52.22,30.07 45.52,30.07 44.5,29.06 TP40.TP | U$5.P$2 52.86,27.23 | 52.86,27.23 C23.1
REFIN_DAC
  Top 0.254: IC23.6 53.77,47.04 49.28,51.53 | 53.34,55.37 TP15.TP
  Top 0.406: IC8.5 49.28,51.53 49.84,51.53 C28.1 52.49,51.98 53.34,52.83 53.34,55.37
RES_BIAS_EXT
  Top 0.254: IC1.6 78.21,38.79 79.86,40.44 79.86,43.48 81.89,45.52 | 81.89,45.52 82.5,46.13 82.6,46.23 | JP4.2 95.5,46.74 94.28,47.95 84.33,47.95 81.89,45.52
RST
  Top 0.254: R36.1 R37.2 69.94,17.61 69.94,17.92 70.71,18.69 | 70.71,18.69 70.81,18.8 | IC1.38 75.71,27.55 75.71,27.35 75.69,27.33 74.37,26.01 73.56,25.2 71.93,25.2 70.92,24.18 70.92,18.9 70.71,18.69
RST_CSA  (via drill 0.6)
  Top 0.254: IC1.12 75.21,39.04 75.69,39.52 76.61,39.52 v76.71,39.62
  Bottom 0.254: R28.1 R29.2 80.43,18.12 79.55,19 79.55,26.62 79.25,26.92 78.74,27.43 78.74,30.48 75.69,33.53 75.69,38.61 v76.71,39.62
RST_CSA_T
  Bottom 0.254: R28.2 82.13,12.76 82.8,12.09 J1.A33
RST_T
  Top 0.254: J1.A24 71.37,10.92 68.38,13.92 68.38,15.1 R36.2
SDI_DAC  (via drill 0.6)
  Top 0.254: IC23.9 52.53,42.68 52.32,42.47 v52.32,39.83
  Bottom 0.254: v52.32,39.83 52.32,38.41 56.19,34.54 56.19,34.34 56.19,22.45 56.19,22.15 60.05,18.29 63.7,14.63 63.7,11.18 63.7,9.58 J1.A18
SDI_REF  (via drill 0.6)
  Top 0.254: IC18.5 8.78,47.51 7.52,48.77 7.52,49.58 v7.32,49.78 | IC19.5 9.39,33.28 v6.91,35.76 | IC20.5 8.88,18.55 v8.74,18.69
  Bottom 0.254: v8.74,18.69 9.96,18.69 | 9.96,18.69 12.6,16.05 12.8,15.85 45.11,15.85 48.56,12.39 48.56,9.58 J1.A6 | 9.96,18.69 8.53,18.69 7.32,19.91 7.32,25.6 7.92,26.21 8.13,26.42 8.13,33.73 | 8.13,33.73 8.13,48.97 v7.32,49.78 | v6.91,35.76 6.91,34.95 8.13,33.73
SDO_ADC1
  Top 0.254: IC22.P$8 93.5,14.8 94.79,13.51 | 94.79,13.51 95.3,13.01 95.5,12.8 J1.A43 | 93.98,12.7 94.79,13.51
  Top 0.406: R3.1 93.98,12.7
SDO_ADC2
  Top 0.254: U$5.P$8 52.86,20.49 54.71,18.64 | 54.71,18.64 58.73,14.63 58.73,9.58 J1.A14 | R7.1 53.85,17.78 54.71,18.64
SGN
  Top 0.254: R35.2 R34.1 74,24.83 74.57,25.4 76.2,27.03 76.2,27.43 IC1.39
SGN_T
  Top 0.254: R34.2 71.83,23.88 71.42,23.47 71.42,13.31 72.64,12.09 J1.A25
V0NDAC
  Top 0.254: 62.28,40.44 IC21.5 62.29,38.93 62.29,38.82 61.47,38 61.27,37.8 58.73,37.8 57.91,38.61 57.4,39.12 56.39,40.13 56.39,42.16 56.9,42.68 IC23.2
V0PDAC
  Top 0.254: IC23.1 60.03,42.18 60.45,41.76 60.45,40.49 IC21.2
V1NDAC
  Top 0.254: IC21.14 61.06,45.89 61.06,44.81 60.44,44.18 IC23.5 58.2,44.18 58.83,44.81 58.83,46.16 C53.1
V1PDAC
  Top 0.254: IC21.11 62.89,45.89 62.89,44.4 62.17,43.68 IC23.4 56.7,43.68 56.59,43.79 55.84,44.54 C52.1
V_REF_PRECHAR  (via drill 0.6)
  Top 0.254: IC1.7 77.71,40.12 v78.23,40.64 | 41.15,43.69 JP7.2
  Top 0.406: TP37.TP 38.61,42.16 JP7.2
  Bottom 0.254: JP7.2 40.64,47.55 41.45,48.36 70.71,48.36 | 70.71,48.36 70.87,48.51 | 70.87,48.51 71.12,48.77 | 71.12,48.77 71.93,49.58 76.2,49.58 78.44,47.35 78.44,40.84 v78.23,40.64 | 70.71,48.36 70.87,48.51 | 70.71,48.36 71.12,48.77
V_REF_PRECHAR_BUFF
  Top 0.254: IC14.1 29.62,45.97 29.67,45.92 | 29.67,45.92 29.12,45.92 IC14.2 | 29.67,45.92 31.86,45.92 C34.1 34.81,46.06 36.23,46.06 JP7.1
VDD  (via drill 0.6)  (3 unrouted)
  Top 0.254: IC21.16 59.75,47.94 58.93,48.77 C39.2 57.61,48.91 v57.61,50.8 | C20.1 C19.1 49.53,24.3 U$5.P$4 | 47.41,24.38 C20.1 | C16.1 C15.1 | IC22.P$4 90,22.27 C15.1 | 90.32,22.59 C15.1 | IC23.8 48.46,43.18 v48.26,42.98 | v45.82,28.04 45.82,25.5 47.14,24.18 47.61,24.18 C20.1 | 88.12,22.19 87.01,22.19 86.97,22.15 86.46,21.64 v86.46,20.12
  Top 0.305: IC5.3 IC5.4 5.87,43.32 C3.1
  Top 0.406: C44.1 40.63,69.76 39.79,68.92 | 39.79,68.92 39.18,68.31 | 39.18,68.31 IC11.3 | TP5.TP 40.13,68.58 39.79,68.92 | IC6.3 IC6.4 5.22,29.9 C1.1 5.42,28.65 v6.91,28.65 | IC7.3 IC7.4 5.22,15.16 5.22,15.04 | C2.1 5.22,15.04 | IC18.2 13.05,50.44 13.61,51 16.26,51 18.39,48.87 | 18.39,48.87 19.71,47.55 19.71,46.53 19.91,46.33 20.02,46.23 IC2.5 | v19.3,49.99 19.3,49.78 18.39,48.87 | IC19.2 13.05,36.22 13.41,36.58 14.22,36.58 18.09,32.72 | 18.09,32.72 19.51,32.72 19.71,32.51 19.71,31.5 20.12,31.09 20.22,30.99 IC3.5 | 18.09,32.72 18.09,34.34 v18.29,34.54 | IC20.2 13.05,21.58 13.41,21.95 16.66,21.95 18.8,19.81 | 18.8,19.81 19.71,18.9 19.71,17.68 19.91,17.48 20.12,17.27 IC4.5 | v19.71,20.93 19.71,20.73 18.8,19.81 | v6.5,14.02 6.24,14.02 5.22,15.04 | v40.64,67.06 40.44,67.06 39.18,68.31 | IC8.4 IC8.3 46.52,53.85 45.21,53.85 | C4.1 45.21,53.85 | 45.21,53.85 45.21,53.95 44.81,54.36 v44.2,54.36 | IC16.3 IC16.4 109.8,32.15 C25.1 111.25,32.65 v111.25,34.04 | C16.1 88.12,22.19 | 5.87,43.32 6.46,43.32 6.91,42.88 v6.91,41.45
  pour Route3: 0,76.2 124.97,76.2 124.97,0 0,0
VDD2  (via drill 0.6)
  Top 0.406: IC9.3 55.16,67.51 56.56,68.92 | 56.56,68.92 C46.1 | TP6.TP 58.32,68.58 | 58.32,68.58 56.9,68.58 56.56,68.92 | IC13.3 88.13,43.06 C7.1 87.42,42.47 86.56,42.47 86.36,42.27 86.36,41.66 | IC13.4 88.82,40.46 88.19,39.83 86.97,39.83 86.36,40.44 86.36,41.66 | IC10.3 51.38,32.37 C5.1 52.69,32.37 53.44,33.12 53.44,34.14 52.83,34.75 51.41,34.75 | 51.41,34.75 51.16,34.75 IC10.4 | v84.94,42.67 85.34,42.67 86.36,41.66 | v50.39,36.17 50.39,35.76 51.41,34.75 | v57.91,66.24 57.91,68.17 58.32,68.58
  Route3 0.406: v50.39,36.17 50.39,53.65 | 50.39,53.65 50.39,59.54 50.39,60.55 54.86,65.02 56.69,65.02 v57.91,66.24 58.01,66.14 | v84.94,42.67 75.39,52.22 52.43,52.22 51.82,52.22 50.39,53.65
VDD_REF_1  (1 unrouted)
  Top 0.305: 8.38,46.38 8.09,46.67 IC5.5 5.87,47.81 C26.1 | 8.38,46.38 R4.1 | IC18.7 13.05,46.58 12.8,46.33 8.43,46.33 8.38,46.38
VDD_REF_2  (1 unrouted)
  Top 0.254: R5.1 9.39,30.44 8.64,31.19 | 8.64,31.19 7.42,32.41 5.91,32.41 IC6.5 5.42,32.9 C27.1 | IC19.7 13.05,32.76 12.29,32 9.45,32 8.64,31.19
VDD_REF_3  (1 unrouted)
  Top 0.254: IC20.7 13.05,17.32 12.9,17.17 11.44,15.71 R6.1 10.04,15.65 8.53,15.65 6.47,17.71 IC7.5 5.87,18.85 C35.1
VDD_SUPPLY_1
  Top 0.406: JP5.1 24.89,66.55 | 24.89,66.55 28.96,66.55 29.92,67.51 32,67.51 | TP1.TP 25.91,67.56 24.89,66.55 | IC11.1 32,67.51 | C43.1 31.5,68.02 32,67.51
VDD_SUPPLY_2
  Top 0.406: JP8.1 21.84,64.01 23.37,65.53 25.4,65.53 | 25.4,65.53 28.45,65.53 | 28.45,65.53 28.96,65.53 | TP3.TP 25.91,65.02 25.4,65.53 | IC9.1 48.77,67.51 | 48.77,67.51 48.21,67.51 46.23,65.53 28.45,65.53 | C45.1 48.26,68.02 48.77,67.51
VDD_SUPPLY_IN_1  (via drill 0.6)
  Top 0.254: IC12.8 30.67,19.11 v30.99,18.8 | v30.99,41.15 30.45,41.15 IC14.8
  Top 0.406: JP17.1 13.72,66.55 | 13.72,66.55 JP5.2 | TP2.TP 12.7,67.56 13.72,66.55
  Route3 0.254: 17.78,66.55 JP5.2
  Route3 0.406: 32.51,39.62 32.51,47.24 28.45,51.31 16.76,51.31 15.24,52.83 15.24,64.01 17.78,66.55 | 32.51,39.62 32.51,19.81 31.5,18.8 v30.99,18.8 | 32.51,39.62 v30.99,41.15
VDD_SUPPLY_IN_2
  Top 0.406: JP17.2 7.62,64.01 8.64,65.02 11.68,65.02 | 11.68,65.02 16.26,65.02 17.53,65.02 JP8.2 | TP4.TP 12.7,64.01 11.68,65.02
VI+_FIL
  Top 0.254: JP11.2 68.73,36.52 70.71,34.54 70.73,34.52 IC1.22
VI+_FIL_DAC  (via drill 0.6)
  Top 0.254: JP11.1 66.65,37.08 66.69,37.08 C54.1 | IC21.4 61.66,39 61.47,38.81 v60.25,38.81
  Bottom 0.254: v60.25,38.81 64.47,38.81 JP11.1
VI-_FIL
  Top 0.254: IC1.23 69.33,34.02 68.34,34.02 JP12.2
VI-_FIL_DAC
  Top 0.254: JP12.1 64.07,35.75 63.88,35.94 | IC21.7 63.56,37.08 63.56,36.26 63.88,35.94 | C55.1 62.89,34.95 63.88,35.94
VICM  (via drill 0.6)
  Top 0.254: IC1.40 76.71,30.17 v76.61,30.28 | JP15.2 38.1,22.35 38.61,21.84 40.64,21.84 43.48,19 43.48,17.48 45.21,15.75 45.21,15.24 TP12.TP | JP15.2 38.1,24.38 JP15.2 | IC21.3 61.02,41.62 61.27,41.86 62.69,41.86 62.89,41.66 62.93,41.62 IC21.6 62.93,38.65 61.57,37.29 60.76,37.29 v60.15,36.68
  Route2 0.254: JP15.2 38.1,23.37 38.3,23.37 39.83,21.84 62.48,21.84 69.29,28.65 74.98,28.65 v76.61,30.28 76.61,31.8 72.75,35.66 64.52,35.66 63.5,36.68 v60.15,36.68
VICM_BUFF
  Top 0.254: IC12.2 IC12.1 29.62,24.04 30.48,24.89 30.73,25.15 | 30.73,25.15 30.99,25.4 34.04,25.4 JP15.1 | C32.1 31.5,24.38 30.73,25.15
VICM_MUX
  Top 0.254: 26.26,26.77 25.7,27.33 22.7,30.34 IC3.4 | IC12.3 28.35,23.23 28.35,24.69 28.35,25.3 29.21,26.16 | C47.1 25.91,26.42 26.26,26.77 | 30.07,26.42 40.13,26.42 40.64,25.91 JP15.3 | 30.07,26.42 29.46,26.42 29.21,26.16 | TP11.TP 30.89,27.23 30.07,26.42 | 26.26,26.77 28.6,26.77 29.21,26.16
VIN_CSA
  Top 0.254: JP1.3 73.71,41.66 IC1.15 | JP10.2 JP1.3 | TP20.TP 77.72,50.8 77.01,50.09 77.01,46.53 76.4,45.92 73.15,45.92 72.54,45.31 72.54,42.88 73.3,42.11 JP1.3
VIN_CSA_1
  Top 0.254: JP9.1 68.28,44.86 68.28,45.72 | 68.28,46.67 C36.1 68.28,46.88 68.28,45.72 | IC21.9 64.2,46.42 64.52,46.74 66.04,46.74 | 66.04,46.74 67.26,46.74 68.28,45.72 | C56.1 65.61,46.3 66.04,46.74
VL_ADC  (via drill 0.6)
  Top 0.254: U$5.P$7 51.96,20.13 C21.1 C22.1 51.65,17.61 51.31,17.27 | v48.77,16.76 50.8,16.76 51.31,17.27 | 51.31,17.27 52.53,16.05 53.68,14.9 R7.2 | TP16.TP 105.5,32.51 C29.1 | C14.1 C8.1 91.95,18.29 92.6,18.94 IC22.P$7 | 92.46,14.94 v92.15,14.63
  Top 0.406: IC16.5 106.8,32.35 C29.1 105.5,32.35 v103.63,30.48 | R3.2 92.11,14.59 v92.15,14.63 91.27,15.51 C14.1
  Route3 0.406: v48.77,16.76 50.29,15.24 53.34,12.19 92.86,12.19 97.74,17.07 | v103.63,30.48 103.63,22.96 97.89,17.22 | 97.74,17.07 97.89,17.22 | 97.74,17.07 97.89,17.22 | 97.74,17.07 94.59,17.07 v92.15,14.63
VO+_BP_FIL
  Top 0.254: IC1.24 70.51,33.52 69.9,32.92 69.49,32.51 64.41,32.51 JP3.3
VO+_CH
  Top 0.254: IC1.50 82.24,30.02 82.65,30.02 JP13.3
VO+_FIL
  Top 0.254: JP3.1 66.85,25.4 69.09,27.64 70.92,27.64 71.73,28.45 71.73,30.28 71.93,30.48 72.52,30.48 IC1.30
VO-_BP_FIL  (via drill 0.6)
  Top 0.254: IC1.25 71.43,33.02 v70.92,32.51
  Bottom 0.254: v70.92,32.51 63.6,32.51 | 63.6,32.51 62.99,32.51 | JP18.3 59.64,31.19 60.96,32.51 63.6,32.51
VO-_CH
  Top 0.254: IC1.52 83.78,31.02 JP14.3
VO-_FIL  (via drill 0.6)
  Top 0.254: IC1.31 73.31,30.02 v73.97,30.68
  Bottom 0.254: JP18.1 59.64,25.3 61.16,23.77 63.4,23.77 70.1,30.48 73.76,30.48 v73.97,30.68
VOCM  (via drill 0.6)
  Top 0.254: IC1.36 74.71,29.53 74.57,29.67 73.97,29.67 73.71,29.41 IC1.34 73.71,27.99 73.36,27.64 v72.54,27.64 | TP14.TP 37.59,18.8 JP16.2
  Route2 0.254: v72.54,27.64 69.29,27.64 62.79,21.13 39.93,21.13 | 39.93,21.13 39.62,20.83 | 39.62,20.83 JP16.2 | 39.93,21.13 39.62,20.83
VOCM_1
  Top 0.254: IC2.4 22.86,45.58 | 22.86,45.58 24.24,45.58 24.79,46.13 25.34,46.13 C49.1 26.55,44.91 28.04,44.91 28.32,45.19 IC14.3 28.32,46.81 28.65,47.14 41.76,47.14 42.27,47.14 43.18,46.23 JP7.3 | TP30.TP 24.38,47.1 22.86,45.58
VOCM_BUFF
  Top 0.254: IC12.6 IC12.7 28.97,19.83 29.46,20.32 31.5,20.32 32.35,20.32 33.19,19.48 | JP16.1 33.36,19.3 33.19,19.48 | C33.1 33.02,19.3 33.19,19.48
VOCM_MUX
  Top 0.254: C48.1 23.88,20.02 | 23.88,20.02 24.69,19.2 24.89,19 27.56,19 IC12.5 27.67,20.05 27.67,20.56 28.25,21.13 38.81,21.13 39.01,20.93 JP16.3 | 23.88,20.02 23.88,18.8 22.86,17.78 | 22.86,17.78 22.1,17.02 | 22.1,17.02 21.84,16.76 | IC4.4 21.7,16.62 22.1,17.02 | TP13.TP 25.4,15.24 22.86,17.78
VOUT_CSA
  Top 0.254: IC1.54 82.52,32.02 83.01,32.51 90.12,32.51 91.14,31.5 91.14,30.79 JP19.3 92.56,29.36 TP9.TP
VSS  (via drill 0.6)
  Top 0.254: IC12.4 27.67,24.14 v26.92,24.89 | v27.43,48.26 27.43,46.31 IC14.4
  Route3 0.254: v27.43,48.26 26.92,48.26
  Route3 0.406: 23.62,44.96 23.37,45.21 17.27,45.21 6.1,56.39 JP17.4 | 23.62,44.96 26.42,42.16 26.42,25.4 v26.92,24.89 | 26.92,48.26 23.62,44.96

### Text on the board
tNames: C43 | C44 | C45 | C46 | TP2 | TP1 | TP5 | TP6 | JP5 | JP8 | TP4 | TP3 | JP2 | TP31 | TP28 | JP6 | TP19 | TP18 | C28 | TP15 | TP29 | TP20 | TP21 | TP30 | C4 | C57 | IC8 | JP4 | C26 | IC18 | C37 | TP23 | IC5 | C36 | C49 | C49 | C34 | JP7 | C38 | TP27 | C56 | C7 | C41 | C3 | TP37 | JP9 | JP10 | JP1 | TP23 | C54 | IC13 | TP24 | TP34 | TP31 | C6 | C9 | C10 | TP7 | TP8 | JP11 | C27 | IC19 | C5 | C55 | TP16 | C31 | JP12 | TP10 | C29 | IC17 | IC6 | TP38 | JP14 | C25 | TP11 | TP40 | C40 | IC10 | C24 | JP13 | IC16 | C1 | C13 | C12 | C11 | JP19 | TP9 | C30 | TP25 | C23 | C18 | TP39 | C32 | JP15 | R38 | R34 | R18 | R22 | C17 | TP32 | C20 | C19 | JP18 | JP3 | TP35 | R39 | R35 | R19 | R23 | C35 | C48 | C47 | JP16 | C21 | IC22 | TP33 | IC7 | IC20 | C22 | R33 | R37 | R15 | R17 | R21 | R25 | C8 | R7 | C14 | C42 | C33 | R32 | R36 | R14 | R16 | R20 | R24 | TP14 | TP12 | C2 | TP26 | TP13 | R3 | R8 | R9 | TP36
bNames: R30 | R28 | R40 | R31 | R27 | R41 | R29 | R43 | R28 | R42